# EAGLE board soundpuddle_standalone_mk1 (EAGLE 6.3), part 1 of 2
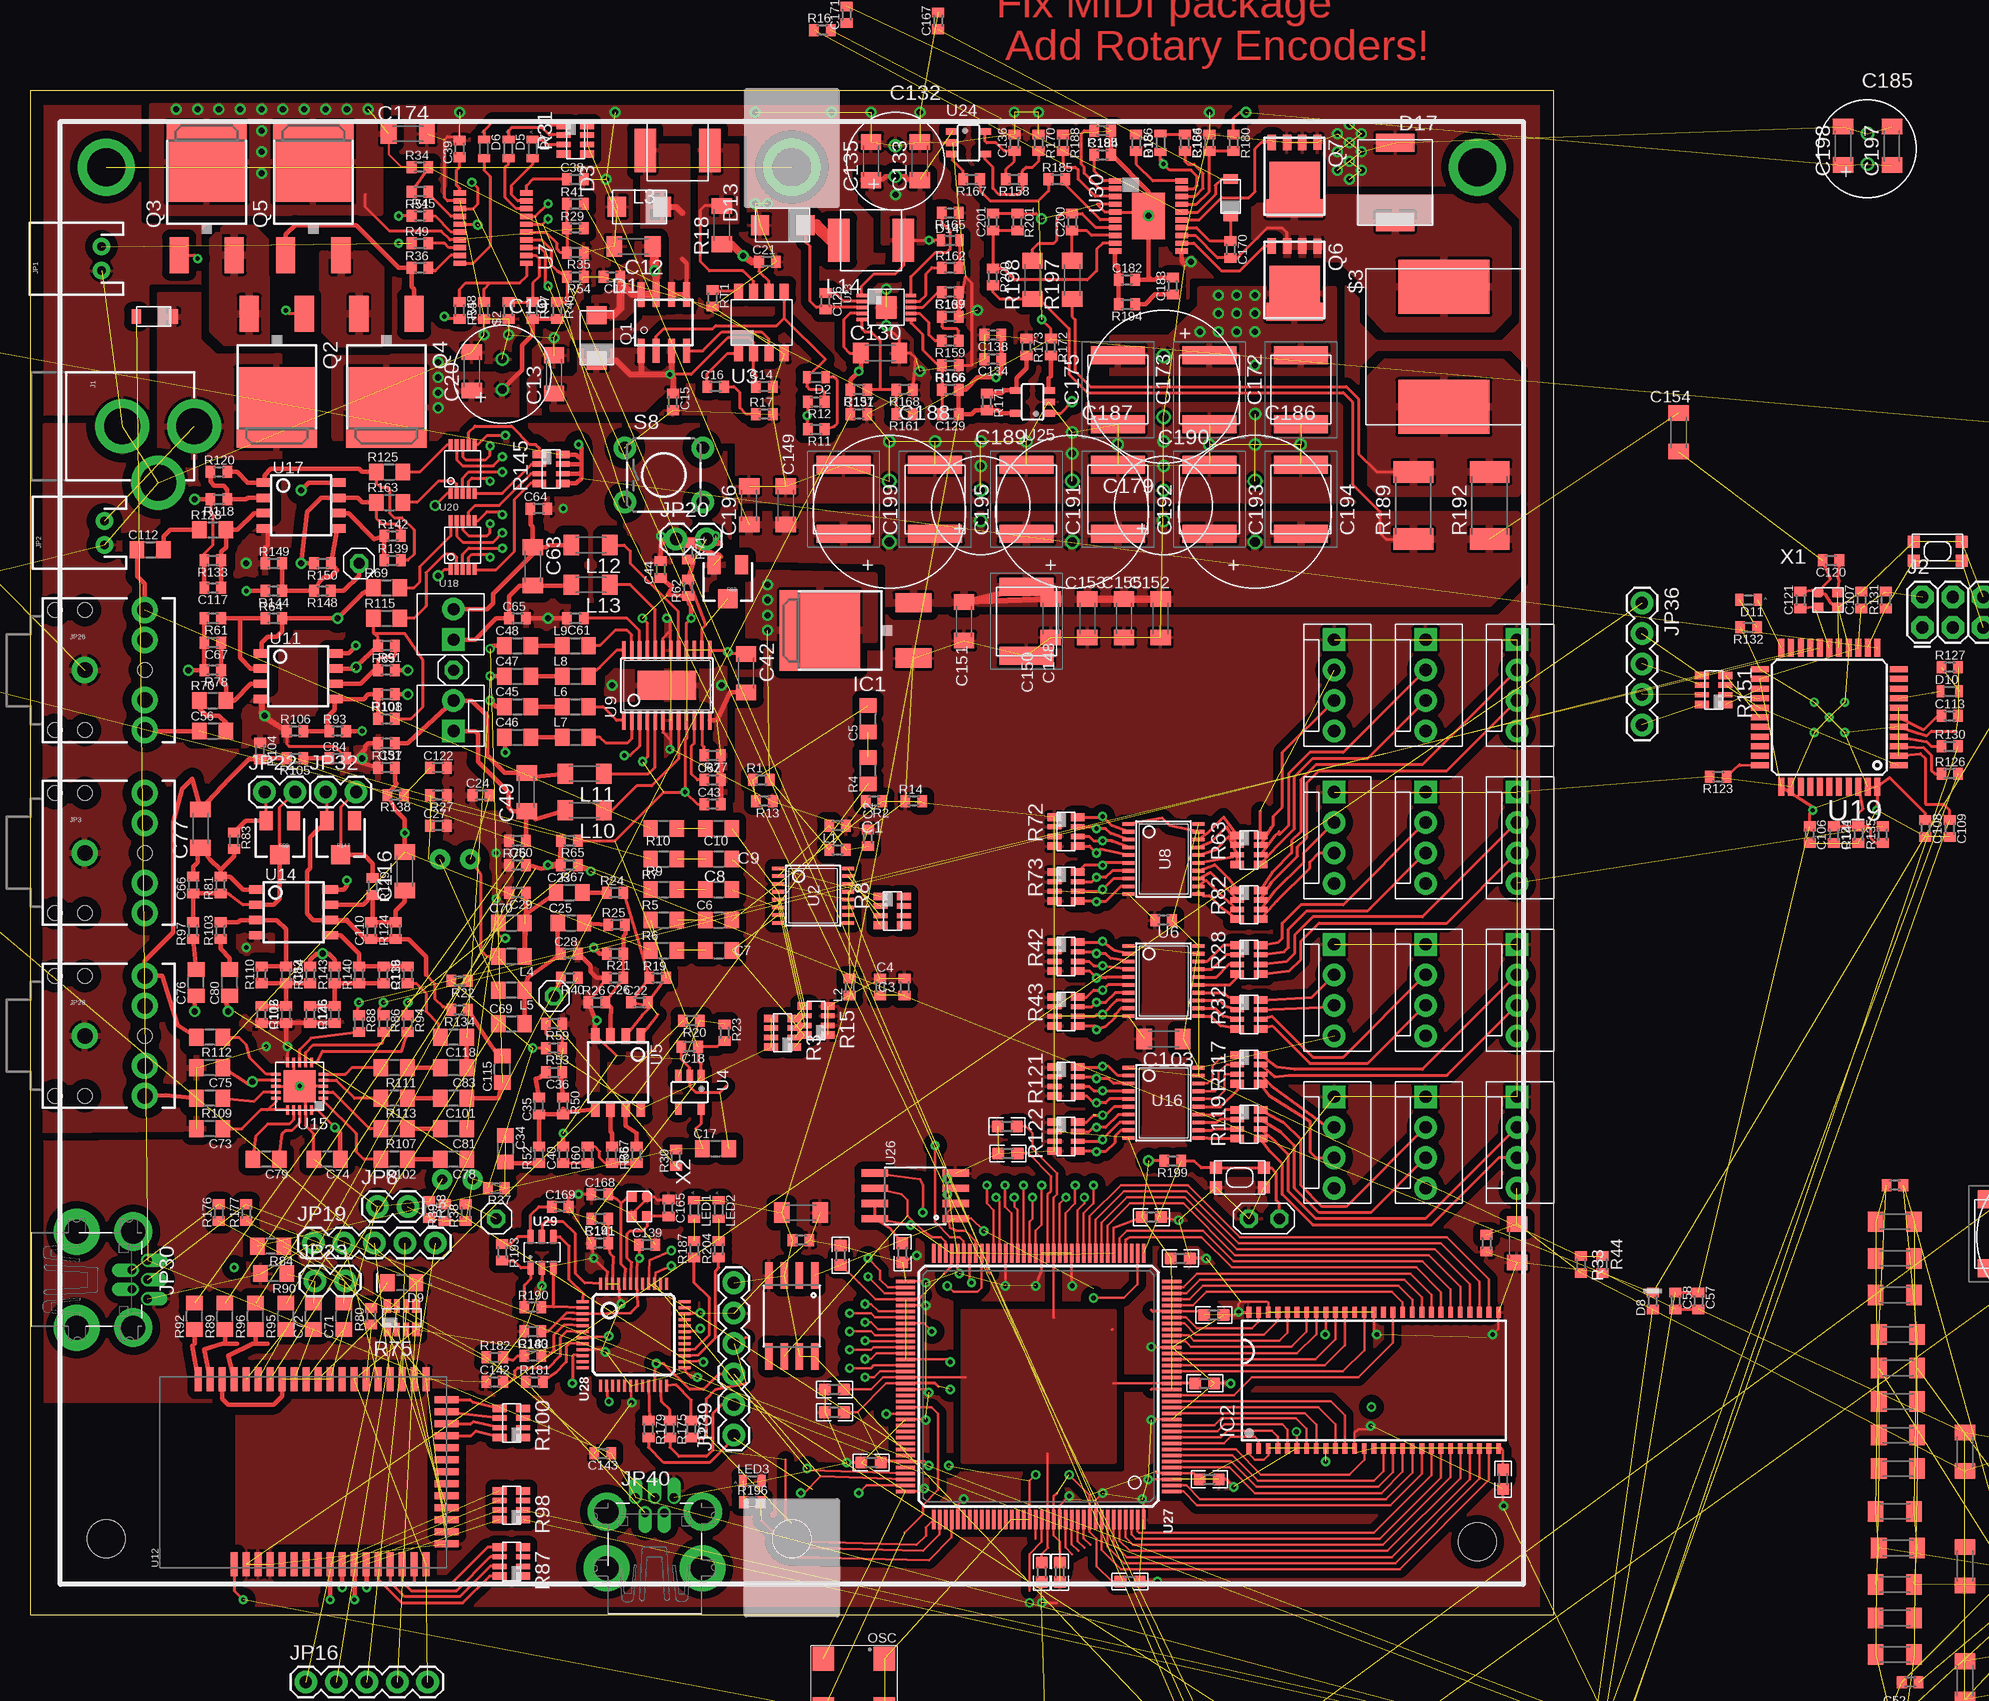
[diagram p8: board, top side]
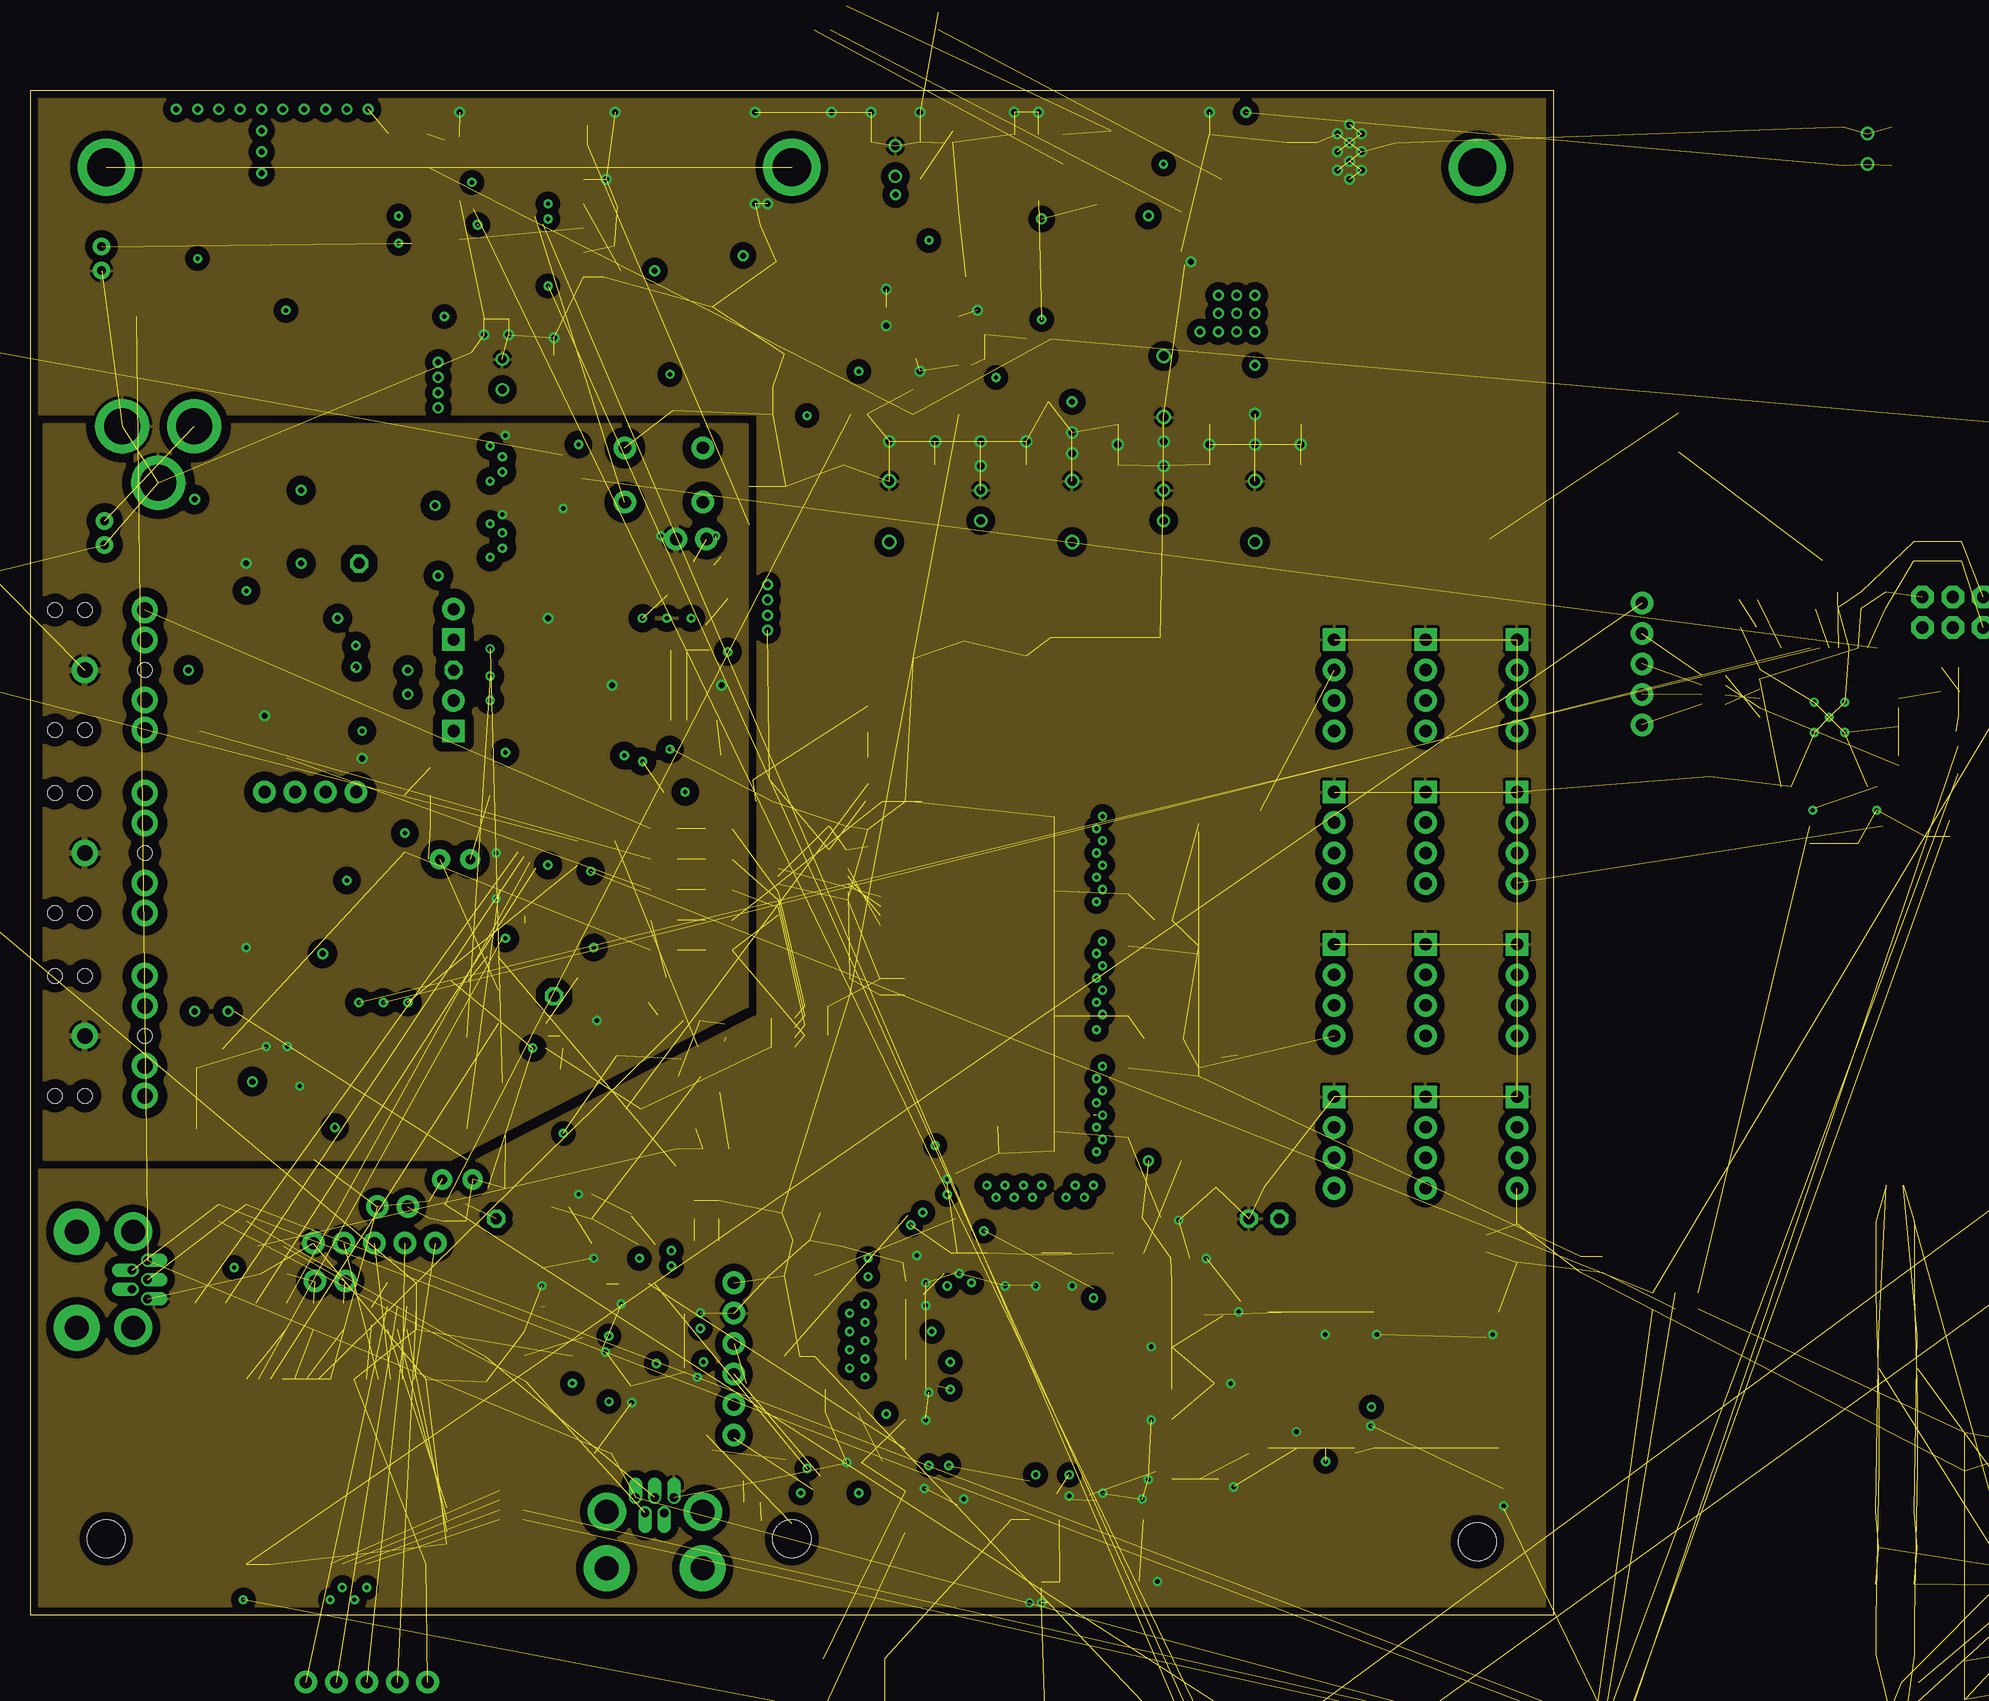
[diagram p9: board, inner layer GND]
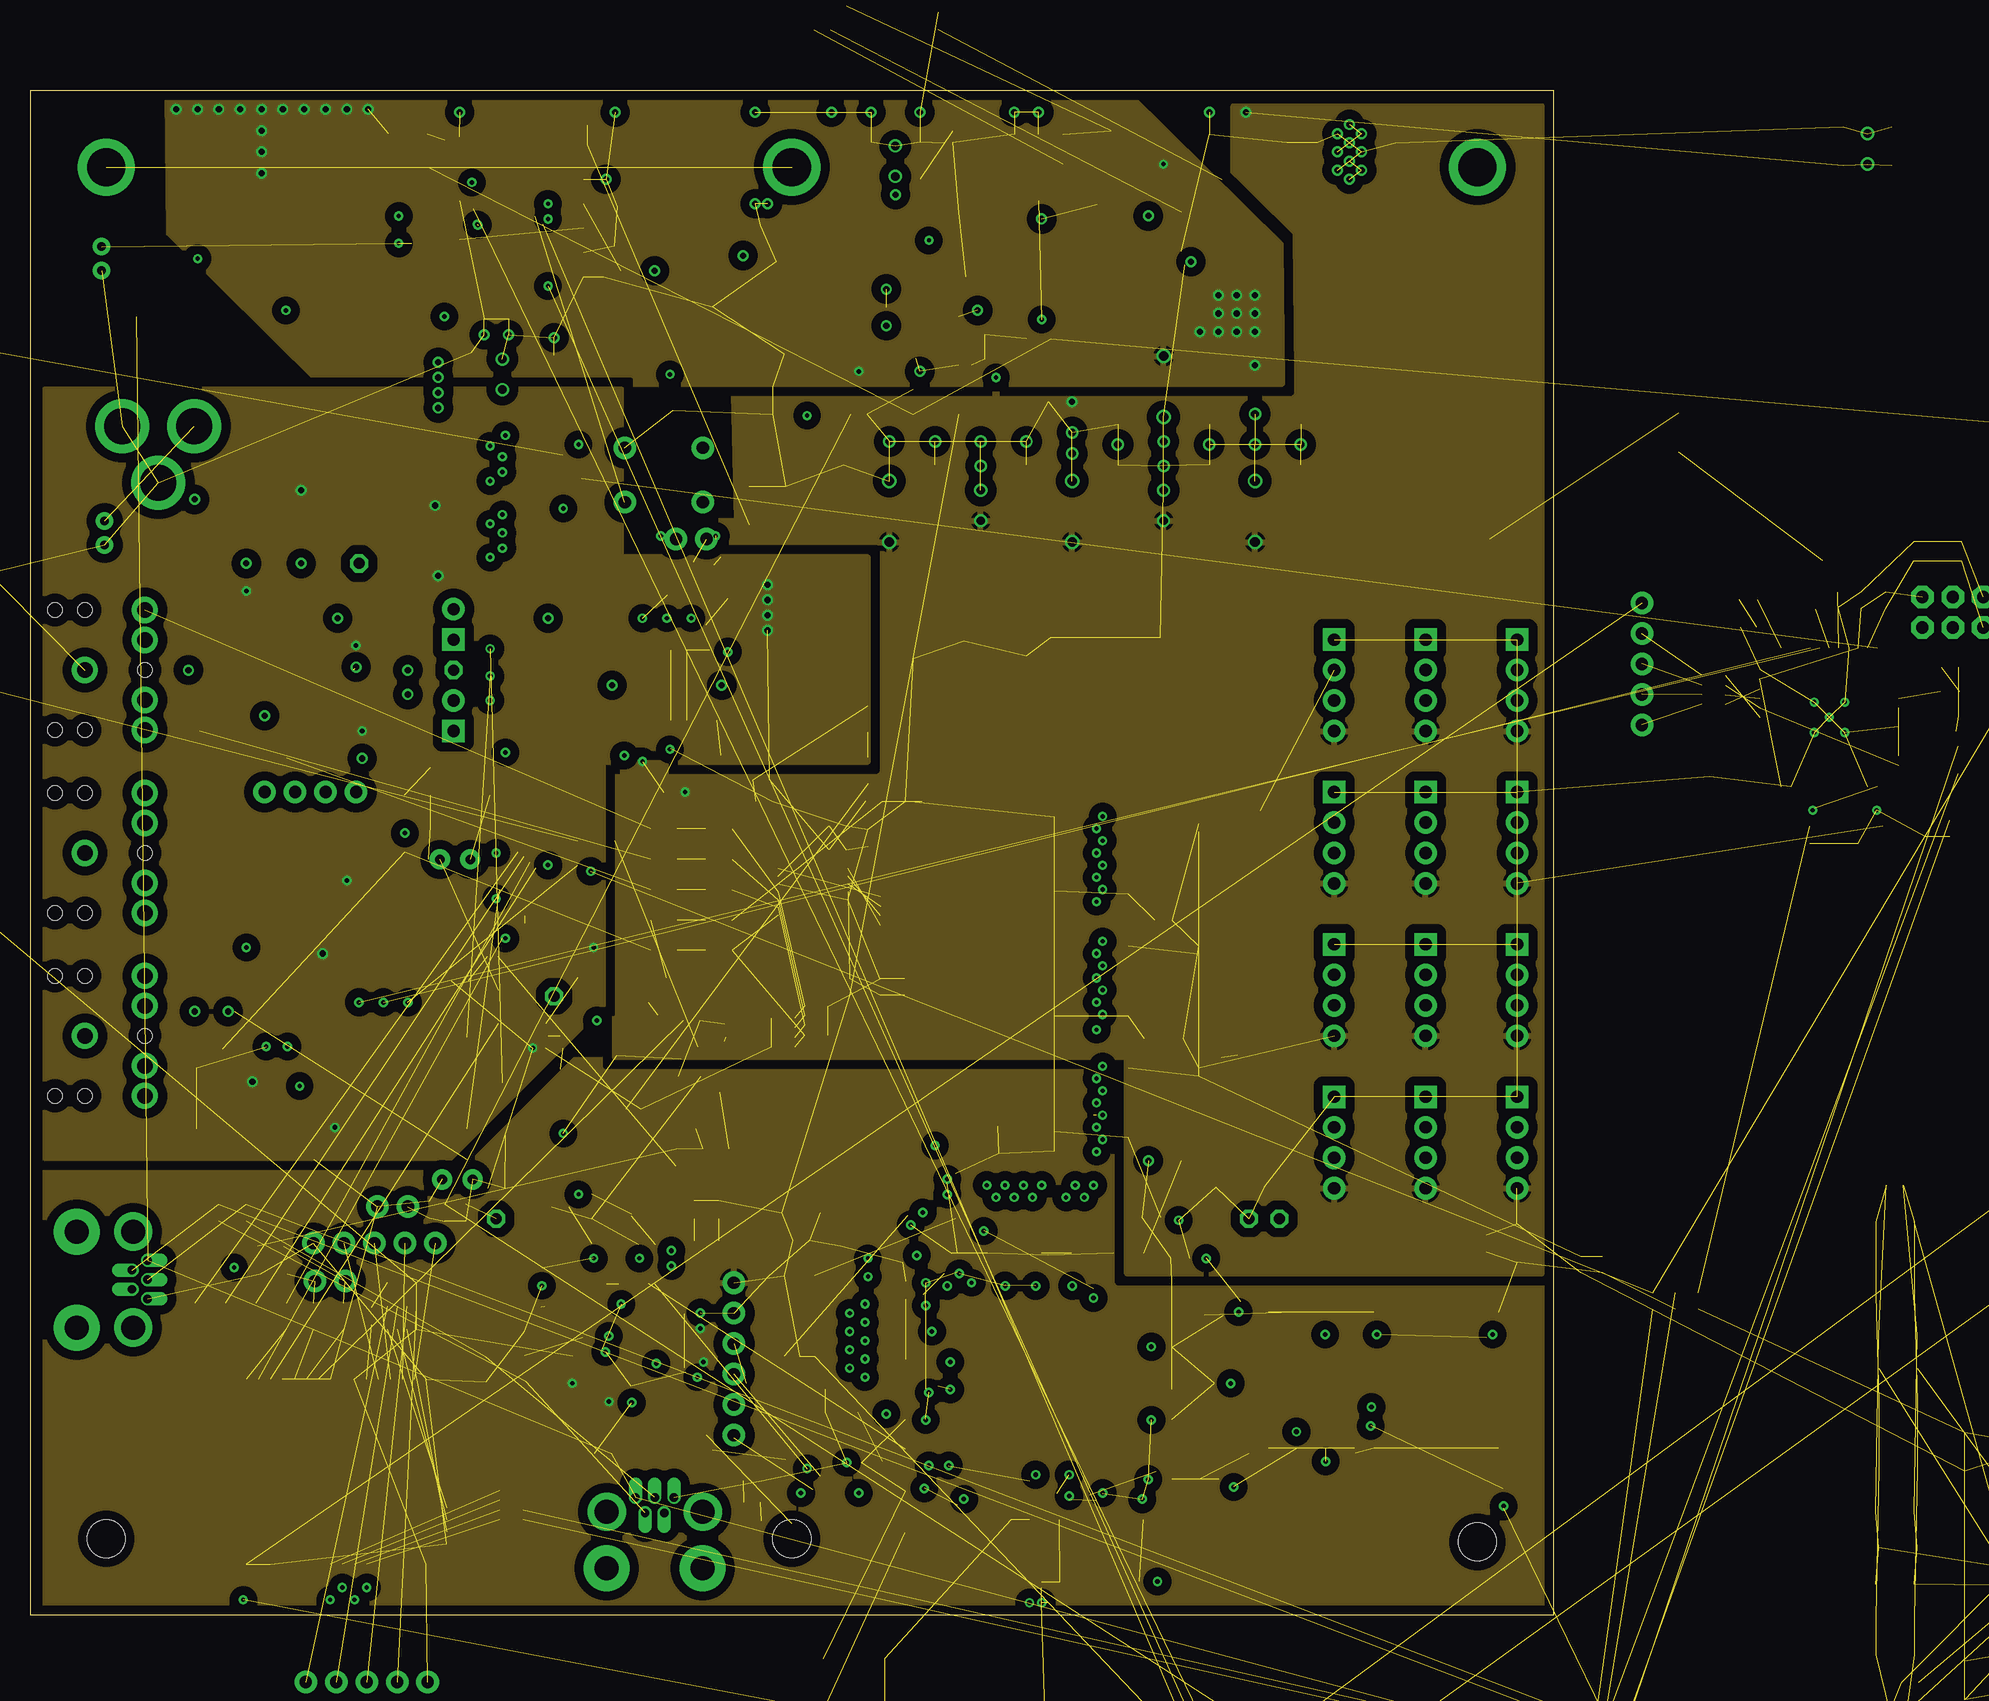
[diagram p10: board, inner layer POWER]
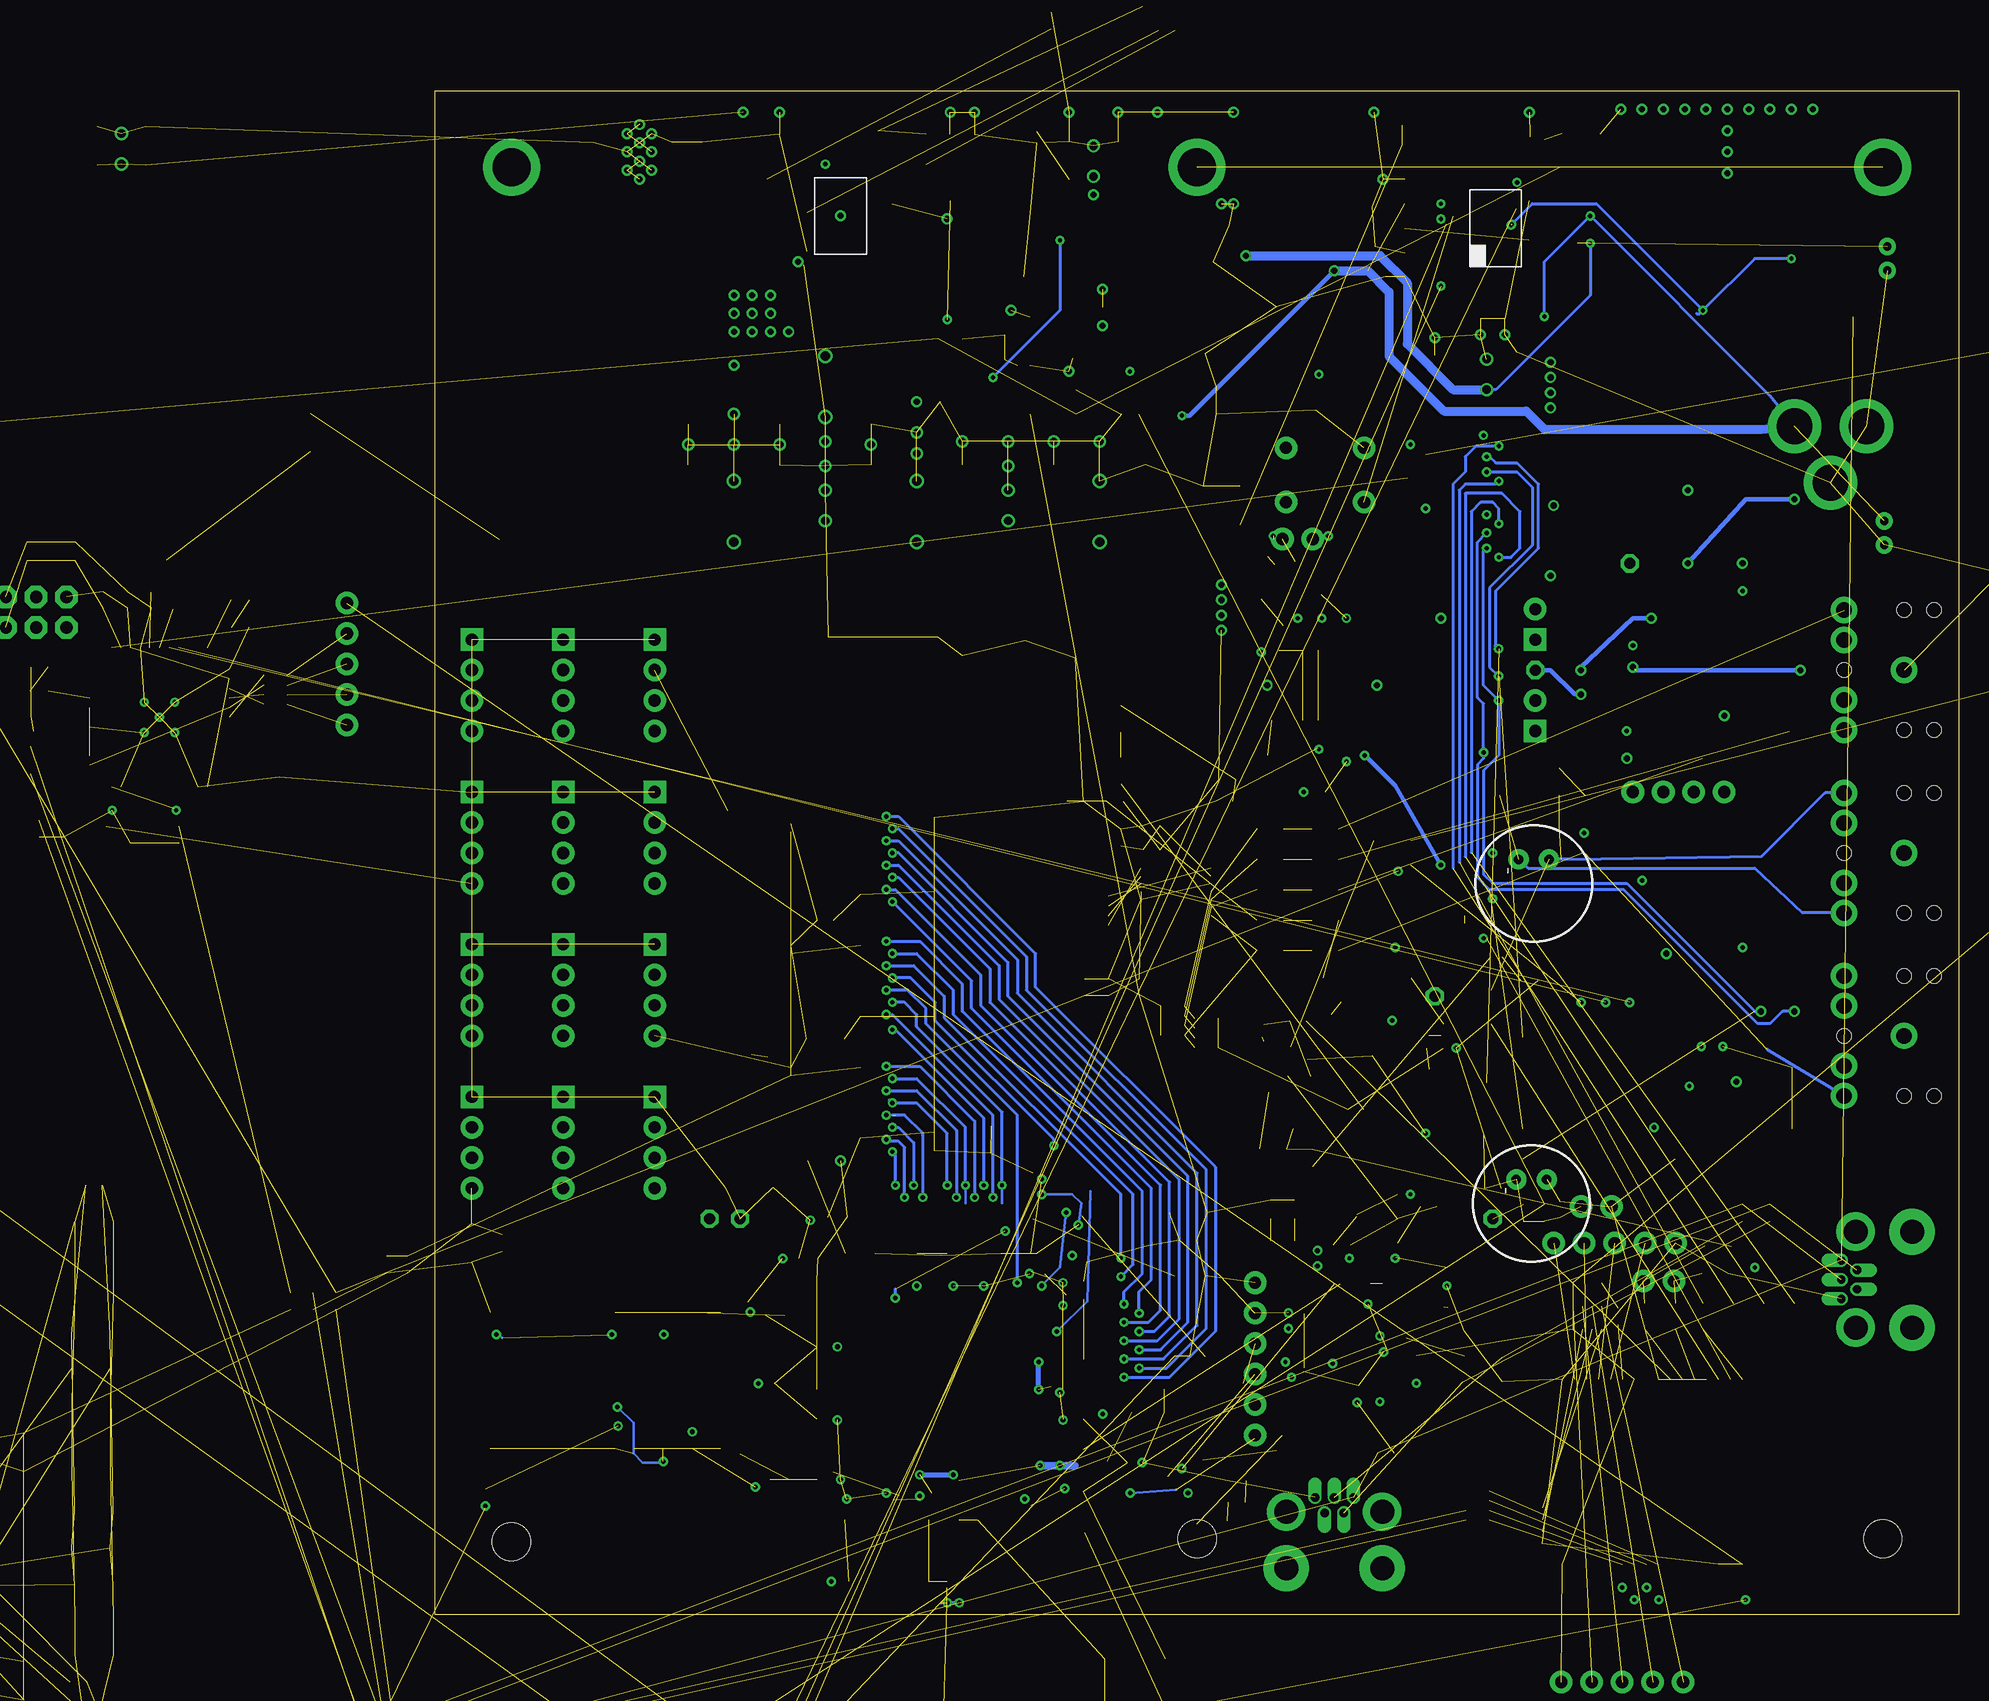
[diagram p11: board, bottom side, seen from below]

Size 127 x 127 mm. Coordinates in mm from the lower left corner, seen from the top.
Outline: 0,0 127,0 127,127 0,127 0,0
Copper layers (1+2*15+16): Top 0.0178mm / dielectric 12mil / GND 0.0356mm / dielectric 28mil / POWER 0.0356mm / dielectric 12mil / Bottom 0.0178mm
Design rules "SSC-EAGLE-4Lyr_v1.0.0.3": minimum track width 6mil, minimum drill 8mil, track to track 6mil, track to pad 6mil, pad to pad 6mil, via to via 6mil, smd to smd 6mil, copper to edge 20mil, drill to drill 16mil, minimum pad ring 8mil, minimum via ring 8mil, stop-mask expansion 3mil, vias tented up to drill 0mil, thermal gap 10mil
Net classes: 0 default: width 0.178 mm, drill 0.381 mm, clearance 0.178 mm
Holes 3.17 mm at 120.65,6.1 63.5,6.35 6.35,6.35
tRestrict: area 0.5,0 to 12.4,17
bRestrict: area 0.5,0 to 12.4,17
vRestrict: area 0.5,0 to 12.4,17

## Footprints (pad centres in the part's own frame; a part is rotated, then mirrored left to right if it is on the bottom)
0603 = smd 0.8 x 1: 1 -0.7,0; 2 0.7,0
INDUCTOR_HC1 = smd 4.5 x 7.62: P$1 -5,0; P$2 5,0
0805 = smd 1.2 x 1.4: 1 -1.1,0; 2 1.1,0
1206 = smd 1.3 x 1.7: P$1 -1.6,0; P$2 1.6,0
CAP_RADIAL_THRUHOLE_6.3MM_DIA = drill 0.7: P$1 0,-1.27; P$2 0,1.27
0603' = smd 1 x 1: 1 -0.8,0; 2 0.8,0
E5-8,5 = drill 1.016 pad 2.54: + -2.54,0 | drill 1.016 pad 2.54 octagon: - 2.54,0
2220 = smd 1.5 x 4.5: P$1 -2.875,0; P$2 2.875,0
CAP_RADIAL_THRUHOLE_12.5MM_DIA = drill 0.8: P$1 0,-2.54; P$2 0,2.54
DIODE_DO-214AC = smd 1.676 x 1.524: P$1 0,1.88; P$2 0,-1.88
LED_0603 = smd 0.65 x 1: 1 -0.775,0; 2 0.775,0
SOD-123F = smd 1.2 x 0.8: P$1 0,1.55; P$2 0,-1.55
0603_D = smd 0.8 x 1: ANNODE(1) -0.7,0; CATHODE(2) 0.7,0
LED_0805 = smd 1.2 x 1.4: 1 -1.2,0; 2 1.2,0
SOD-323 = smd 0.63 x 0.83: A 1.1,0; C -1.1,0
DIODE_DO-214AB = smd 3.2 x 1.524: A 0,-3.302; C 0,3.302
DPACK_1 = smd 1.6 x 3: 1 -2.3,-4.8; 3 2.3,-4.8 | smd 6.7 x 6.7: 2/HEAT 0,3
TSOP54-400 = smd 0.4 x 0.9: 1 -10.4,-5.68; 2 -9.6,-5.68; 3 -8.8,-5.68; 4 -8,-5.68; 5 -7.2,-5.68; 6 -6.4,-5.68; 7 -5.6,-5.68; 8 -4.8,-5.68; 9 -4,-5.68; 10 -3.2,-5.68; 11 -2.4,-5.68; 12 -1.6,-5.68; 13 -0.8,-5.68; 14 0,-5.68; 15 0.8,-5.68; 16 1.6,-5.68; 17 2.4,-5.68; 18 3.2,-5.68; 19 4,-5.68; 20 4.8,-5.68; 21 5.6,-5.68; 22 6.4,-5.68; 23 7.2,-5.68; 24 8,-5.68; 25 8.8,-5.68; 26 9.6,-5.68; 27 10.4,-5.68; 28 10.4,5.68; 29 9.6,5.68; 30 8.8,5.68; 31 8,5.68; 32 7.2,5.68; 33 6.4,5.68; 34 5.6,5.68; 35 4.8,5.68; 36 4,5.68; 37 3.2,5.68; 38 2.4,5.68; 39 1.6,5.68; 40 0.8,5.68; 41 0,5.68; 42 -0.8,5.68; 43 -1.6,5.68; 44 -2.4,5.68; 45 -3.2,5.68; 46 -4,5.68; 47 -4.8,5.68; 48 -5.6,5.68; 49 -6.4,5.68; 50 -7.2,5.68; 51 -8,5.68; 52 -8.8,5.68; 53 -9.6,5.68; 54 -10.4,5.68
POWER_JACK_PTH = drill 2.997 pad 4.318: GND 0,7.7; GNDBREAK 4.7,10.7; PWR 0,13.7
2X3 = drill 1.016 pad 1.88 octagon: 1 0,0; 2 0,2.54; 3 2.54,0; 4 2.54,2.54; 5 5.08,0; 6 5.08,2.54
JST-2-PTH = drill 0.7 pad 1.448: 1 -1,0; 2 1,0
AUDIO-JACK = drill 1.3 pad 2.184: RING 5,5; RSH 5,2.5; SLEEVE 0,0; TIP 5,-5; TSH 5,-2.5 | hole 1.2: 0,5; -2.5,5; -2.5,-5; 0,-5; 5,0
MOLEX-1X4 = drill 1.016 pad 1.88 square: 1 0,0 | drill 1.016 pad 1.88: 2 2.54,0; 3 5.08,0; 4 7.62,0
HEADER-SMALL-1PIN-0.036IN = drill 0.914 pad 1.524 octagon: P$1 0,0
1X02 = drill 1.016 pad 1.88: 1 0,0; 2 2.54,0
1X04 = drill 1.016 pad 1.88 square: 1 0,0 | drill 1.016 pad 1.88: 2 2.54,0; 3 5.08,0; 4 7.62,0
HEADER-SMALL-2PIN-0.036IN = drill 0.914 pad 1.524 octagon: P$1 0,0; P$2 2.54,0
MOLEX-1X2 = drill 1.016 pad 1.88 square: 1 0,0 | drill 1.016 pad 1.88: 2 2.54,0
HEADER-SMALL-3PIN-0.036IN = drill 0.914 pad 1.524 octagon: P$1 0,0; P$2 2.54,0; P$3 5.08,0
1X05 = drill 1.016 pad 1.88: 1 0,0; 2 2.54,0; 3 5.08,0; 4 7.62,0; 5 10.16,0
USB-MINIB-THM = drill 0.7 offset: D+ 0,9.8; D- -0.8,8.5; GND 1.6,9.8; ID 0.8,8.5; VBUS -1.6,9.8 | drill 2 pad 3.81: GND1 -4,3.9; GND4 4,3.9 | drill 2 pad 3.2: GND2 -4,8.6; GND3 4,8.6
HEADER-SMALL-4PIN-0.036IN = drill 0.914 pad 1.524 octagon: P$1 0,0; P$2 2.54,0; P$3 5.08,0; P$4 7.62,0
DIN_5_FEMALE_SUPPORT = drill 1.4 pad 2.286: 1 0.46,3.61; 2 -7.07,3.6; 3 7.94,3.6; 4 -4.53,6.12; 5 5.47,6.13; 6 -2.1,-6.4; 7 2.9,-6.4
1X06 = drill 1.016 pad 1.88: 1 0,0; 2 2.54,0; 3 5.08,0; 4 7.62,0; 5 10.16,0; 6 12.7,0
INDUCTOR_10X10MM = smd 1.803 x 3.607: P$1 -2.692,0; P$2 2.692,0
MIC-9.7MM = drill 0.8 pad 1.676: 1 -2,1.27; 2 -2,-1.27
OSC1 = smd 1.8 x 2: 1@1 0,0; 2@2 5.08,0; 3@3 5.08,4.2; 4@4 0,4.2
SOIC8 = smd 0.6 x 2.032: 1 -1.905,-2.346; 2 -0.635,-2.346; 3 0.635,-2.346; 4 1.905,-2.346; 5 1.905,2.346; 6 0.635,2.346; 7 -0.635,2.346; 8 -1.905,2.346
POWERPAK_SO-8_LFPAK = smd 1.25 x 0.7: 1S -2.825,1.905 | smd 1.27 x 0.7: 2S -2.825,0.635; 3S -2.825,-0.635; 4G -2.825,-1.905 | smd 4.6 x 4.2: PAD 1.1,0 | smd 1.5 x 4.7: PAD2 2.65,0
RESISTOR_ARRAY_1206_4CH_CRA06S = smd 0.63 x 1.15: P$1 -1.2,-0.975; P$4 1.2,-0.975; P$5 1.2,0.975; P$8 -1.2,0.975 | smd 0.44 x 1.15: P$2 -0.4,-0.975; P$3 0.4,-0.975; P$6 0.4,0.975; P$7 -0.4,0.975
TRIMPOT-3MM-2 = smd 1.092 x 1.6: 1 -1.155,-1.421; 3 1.155,-1.421 | smd 1.6 x 1.6: 2 0,1.421
2512 = smd 1.8 x 3.3: 1 -2.8,0; 2 2.8,0
TACTILE-PTH = drill 1.016 pad 1.88: 1 -3.251,2.261; 2 3.251,2.261; 3 -3.251,-2.261; 4 3.251,-2.261
KMR2 = smd 1 x 1: 1 2,0.8; 2 2,-0.8; 3 -2,0.8; 4 -2,-0.8
TSSOP16 = smd 0.305 x 0.991: 1 -2.275,-2.918; 2 -1.625,-2.918; 3 -0.975,-2.918; 4 -0.325,-2.918; 5 0.325,-2.918; 6 0.975,-2.918; 7 1.625,-2.918; 8 2.275,-2.918; 9 2.275,2.918; 10 1.625,2.918; 11 0.975,2.918; 12 0.325,2.918; 13 -0.325,2.918; 14 -0.975,2.918; 15 -1.625,2.918; 16 -2.275,2.918
S8_TI = smd 0.762 x 1.27: P$1 -1.905,-2.603; P$2 -0.635,-2.603; P$3 0.635,-2.603; P$4 1.905,-2.603; P$5 1.905,2.603; P$6 0.635,2.603; P$7 -0.635,2.603; P$8 -1.905,2.603
TSOT23 = smd 0.55 x 1.05: 1 -0.95,-1.35; 2 0,-1.35; 3 0.95,-1.35; 4 0.95,1.35; 5 -0.95,1.35
DMP8_NJM = smd 0.7 x 1.3: 1 -1.905,-3.05; 2 -0.635,-3.05; 3 0.635,-3.05; 4 1.905,-3.05; 5 1.905,3.05; 6 0.635,3.05; 7 -0.635,3.05; 8 -1.905,3.05
TSSOP20 = smd 0.305 x 0.991: 1 -2.925,-2.918; 2 -2.275,-2.918; 3 -1.625,-2.918; 4 -0.975,-2.918; 5 -0.325,-2.918; 6 0.325,-2.918; 7 0.975,-2.918; 8 1.625,-2.918; 9 2.275,-2.932; 10 2.925,-2.932; 11 2.925,2.918; 12 2.275,2.918; 13 1.625,2.918; 14 0.975,2.918; 15 0.325,2.918; 16 -0.325,2.918; 17 -0.975,2.918; 18 -1.625,2.918; 19 -2.275,2.918; 20 -2.925,2.918
TSSOP20_LT = smd 0.45 x 1.05: P$1 -2.925,-2.775; P$2 -2.275,-2.775; P$3 -1.625,-2.775; P$4 -0.975,-2.775; P$5 -0.325,-2.775; P$6 0.325,-2.775; P$7 0.975,-2.775; P$8 1.625,-2.775; P$9 2.275,-2.775; P$10 2.925,-2.775; P$11 2.925,2.775; P$12 2.275,2.775; P$13 1.625,2.775; P$14 0.975,2.775; P$15 0.325,2.775; P$16 -0.325,2.775; P$17 -0.975,2.775; P$18 -1.625,2.775; P$19 -2.275,2.775; P$20 -2.925,2.775
TSSOP24+1_TI = smd 0.3 x 1.55: 1 -3.575,-2.918; 2 -2.925,-2.918; 3 -2.275,-2.918; 4 -1.625,-2.918; 5 -0.975,-2.918; 6 -0.325,-2.918; 7 0.325,-2.918; 8 0.975,-2.918; 9 1.625,-2.918; 10 2.275,-2.918; 11 2.925,-2.918; 12 3.575,-2.918; 13 3.575,2.932; 14 2.925,2.932; 15 2.275,2.932; 16 1.625,2.932; 17 0.975,2.932; 18 0.325,2.932; 19 -0.325,2.932; 20 -0.975,2.932; 21 -1.625,2.932; 22 -2.275,2.918; 23 -2.925,2.918; 24 -3.575,2.918 | smd 4.87 x 2.4: PGND 0,0
LGA14 = smd 0.5 x 1.2: 1 2,1.1; 2 1.2,1.1; 3 0.4,1.1; 4 -0.4,1.1; 5 -1.2,1.1; 6 -2,1.1; 8 -2,-1.1; 9 -1.2,-1.1; 10 -0.4,-1.1; 11 0.4,-1.1; 12 1.2,-1.1; 13 2,-1.1 | smd 1.2 x 0.5: 7 -2.1,0; 14 2.1,0
WT32_BT_MODULE = smd 2 x 0.6: 1 -7.7,6.97; 2 -7.7,5.97; 3 -7.7,4.97; 4 -7.7,3.97; 5 -7.7,2.97; 6 -7.7,1.97; 7 -7.7,0.97; 8 -7.7,-0.03; 9 -7.7,-1.03; 10 -7.7,-2.03; 11 -7.7,-3.03; 12 -7.7,-4.03; 13 -7.7,-5.03; 14 -7.7,-6.03; 15 -7.7,-7.03; 16 -7.7,-8.03; 17 -7.7,-9.03; 31 7.7,-9.03; 32 7.7,-8.03; 33 7.7,-7.03; 34 7.7,-6.03; 35 7.7,-5.03; 36 7.7,-4.03; 37 7.7,-3.03; 38 7.7,-2.03; 39 7.7,-1.03; 40 7.7,-0.03; 41 7.7,0.97; 42 7.7,1.97; 43 7.7,2.97; 44 7.7,3.97; 45 7.7,4.97; 46 7.7,5.97; 47 7.7,6.97; 48 7.7,7.97; 49 7.7,8.97; 50 7.7,9.97 | smd 0.6 x 2: 18 -6,-10.73; 19 -5,-10.73; 20 -4,-10.73; 21 -3,-10.73; 22 -2,-10.73; 23 -1,-10.73; 24 0,-10.73; 25 1,-10.73; 26 2,-10.73; 27 3,-10.73; 28 4,-10.73; 29 5,-10.73; 30 6,-10.73
SOT23-6L = smd 0.55 x 1.05: 1 -0.95,-1.15; 2 0,-1.15; 3 0.95,-1.15 | smd 0.6 x 1.2: 4 0.95,1.15; 5 0,1.15; 6 -0.95,1.15
QFN20+1 = smd 0.8 x 0.25: P$1 -1.975,1; P$2 -1.975,0.5; P$3 -1.975,0; P$4 -1.975,-0.5; P$5 -1.975,-1; P$11 1.975,-1; P$12 1.975,-0.5; P$13 1.975,0; P$14 1.975,0.5; P$15 1.975,1 | smd 0.25 x 0.8: P$6 -1,-1.975; P$7 -0.5,-1.975; P$8 0,-1.975; P$9 0.5,-1.975; P$10 1,-1.975; P$16 1,1.975; P$17 0.5,1.975; P$18 0,1.975; P$19 -0.5,1.975; P$20 -1,1.975 | smd 2.65 x 2.65: PAD 0,0
MSOP10 = smd 0.305 x 0.889: 1 -1,-2.045; 2 -0.5,-2.045; 3 0,-2.045; 4 0.5,-2.045; 5 1,-2.045; 6 1,2.045; 7 0.5,2.045; 8 0,2.045; 9 -0.5,2.045; 10 -1,2.045
TQFP44 = smd 1.5 x 0.5: 1 -5.8,4; 2 -5.8,3.2; 3 -5.8,2.4; 4 -5.8,1.6; 5 -5.8,0.8; 6 -5.8,0; 7 -5.8,-0.8; 8 -5.8,-1.6; 9 -5.8,-2.4; 10 -5.8,-3.2; 11 -5.8,-4; 23 5.8,-4; 24 5.8,-3.2; 25 5.8,-2.4; 26 5.8,-1.6; 27 5.8,-0.8; 28 5.8,0; 29 5.8,0.8; 30 5.8,1.6; 31 5.8,2.4; 32 5.8,3.2; 33 5.8,4 | smd 0.5 x 1.5: 12 -4,-5.8; 13 -3.2,-5.8; 14 -2.4,-5.8; 15 -1.6,-5.8; 16 -0.8,-5.8; 17 0,-5.8; 18 0.8,-5.8; 19 1.6,-5.8; 20 2.4,-5.8; 21 3.2,-5.8; 22 4,-5.8; 34 4,5.8; 35 3.2,5.8; 36 2.4,5.8; 37 1.6,5.8; 38 0.8,5.8; 39 0,5.8; 40 -0.8,5.8; 41 -1.6,5.8; 42 -2.4,5.8; 43 -3.2,5.8; 44 -4,5.8
SO08-EIAJ = smd 0.61 x 2.21: 1 -1.905,-3.378; 2 -0.635,-3.378; 3 0.635,-3.378; 4 1.905,-3.378; 5 1.905,3.353; 6 0.635,3.353; 7 -0.635,3.353; 8 -1.905,3.353
SMD-8 = smd 1.27 x 1.27: P$1 -3.81,-3.81; P$2 -1.27,-3.81; P$3 1.27,-3.81; P$4 3.81,-3.81; P$5 3.81,3.81; P$6 1.27,3.81; P$7 -1.27,3.81; P$8 -3.81,3.81
MSOP10+1_LT = smd 0.305 x 0.889: P$1 -1,-2.045; P$2 -0.5,-2.045; P$3 0,-2.045; P$4 0.5,-2.045; P$5 1,-2.045; P$6 1,2.045; P$7 0.5,2.045; P$8 0,2.045; P$9 -0.5,2.045; P$10 -1,2.045 | smd 1.88 x 1.68: P$11 0,0
TQ144 = smd 1.6 x 0.3: 1 -11.1,8.75; 2 -11.1,8.25; 3 -11.1,7.75; 4 -11.1,7.25; 5 -11.1,6.75; 6 -11.1,6.25; 7 -11.1,5.75; 8 -11.1,5.25; 9 -11.1,4.75; 10 -11.1,4.25; 11 -11.1,3.75; 12 -11.1,3.25; 13 -11.1,2.75; 14 -11.1,2.25; 15 -11.1,1.75; 16 -11.1,1.25; 17 -11.1,0.75; 18 -11.1,0.25; 19 -11.1,-0.25; 20 -11.1,-0.75; 21 -11.1,-1.25; 22 -11.1,-1.75; 23 -11.1,-2.25; 24 -11.1,-2.75; 25 -11.1,-3.25; 26 -11.1,-3.75; 27 -11.1,-4.25; 28 -11.1,-4.75; 29 -11.1,-5.25; 30 -11.1,-5.75; 31 -11.1,-6.25; 32 -11.1,-6.75; 33 -11.1,-7.25; 34 -11.1,-7.75; 35 -11.1,-8.25; 36 -11.1,-8.75; 73 11.1,-8.75; 74 11.1,-8.25; 75 11.1,-7.75; 76 11.1,-7.25; 77 11.1,-6.75; 78 11.1,-6.25; 79 11.1,-5.75; 80 11.1,-5.25; 81 11.1,-4.75; 82 11.1,-4.25; 83 11.1,-3.75; 84 11.1,-3.25; 85 11.1,-2.75; 86 11.1,-2.25; 87 11.1,-1.75; 88 11.1,-1.25; 89 11.1,-0.75; 90 11.1,-0.25; 91 11.1,0.25; 92 11.1,0.75; 93 11.1,1.25; 94 11.1,1.75; 95 11.1,2.25; 96 11.1,2.75; 97 11.1,3.25; 98 11.1,3.75; 99 11.1,4.25; 100 11.1,4.75; 101 11.1,5.25; 102 11.1,5.75; 103 11.1,6.25; 104 11.1,6.75; 105 11.1,7.25; 106 11.1,7.75; 107 11.1,8.25; 108 11.1,8.75 | smd 0.3 x 1.6: 37 -8.75,-11.1; 38 -8.25,-11.1; 39 -7.75,-11.1; 40 -7.25,-11.1; 41 -6.75,-11.1; 42 -6.25,-11.1; 43 -5.75,-11.1; 44 -5.25,-11.1; 45 -4.75,-11.1; 46 -4.25,-11.1; 47 -3.75,-11.1; 48 -3.25,-11.1; 49 -2.75,-11.1; 50 -2.25,-11.1; 51 -1.75,-11.1; 52 -1.25,-11.1; 53 -0.75,-11.1; 54 -0.25,-11.1; 55 0.25,-11.1; 56 0.75,-11.1; 57 1.25,-11.1; 58 1.75,-11.1; 59 2.25,-11.1; 60 2.75,-11.1; 61 3.25,-11.1; 62 3.75,-11.1; 63 4.25,-11.1; 64 4.75,-11.1; 65 5.25,-11.1; 66 5.75,-11.1; 67 6.25,-11.1; 68 6.75,-11.1; 69 7.25,-11.1; 70 7.75,-11.1; 71 8.25,-11.1; 72 8.75,-11.1; 109 8.75,11.1; 110 8.25,11.1; 111 7.75,11.1; 112 7.25,11.1; 113 6.75,11.1; 114 6.25,11.1; 115 5.75,11.1; 116 5.25,11.1; 117 4.75,11.1; 118 4.25,11.1; 119 3.75,11.1; 120 3.25,11.1; 121 2.75,11.1; 122 2.25,11.1; 123 1.75,11.1; 124 1.25,11.1; 125 0.75,11.1; 126 0.25,11.1; 127 -0.25,11.1; 128 -0.75,11.1; 129 -1.25,11.1; 130 -1.75,11.1; 131 -2.25,11.1; 132 -2.75,11.1; 133 -3.25,11.1; 134 -3.75,11.1; 135 -4.25,11.1; 136 -4.75,11.1; 137 -5.25,11.1; 138 -5.75,11.1; 139 -6.25,11.1; 140 -6.75,11.1; 141 -7.25,11.1; 142 -7.75,11.1; 143 -8.25,11.1; 144 -8.75,11.1
LQFP48 = smd 0.25 x 1: 1 -2.75,-4.25; 2 -2.25,-4.25; 3 -1.75,-4.25; 4 -1.25,-4.25; 5 -0.75,-4.25; 6 -0.25,-4.25; 7 0.25,-4.25; 8 0.75,-4.25; 9 1.25,-4.25; 10 1.75,-4.25; 11 2.25,-4.25; 12 2.75,-4.25; 25 2.75,4.25; 26 2.25,4.25; 27 1.75,4.25; 28 1.25,4.25; 29 0.75,4.25; 30 0.25,4.25; 31 -0.25,4.25; 32 -0.75,4.25; 33 -1.25,4.25; 34 -1.75,4.25; 35 -2.25,4.25; 36 -2.75,4.25 | smd 1 x 0.25: 13 4.25,-2.75; 14 4.25,-2.25; 15 4.25,-1.75; 16 4.25,-1.25; 17 4.25,-0.75; 18 4.25,-0.25; 19 4.25,0.25; 20 4.25,0.75; 21 4.25,1.25; 22 4.25,1.75; 23 4.25,2.25; 24 4.25,2.75; 37 -4.25,2.75; 38 -4.25,2.25; 39 -4.25,1.75; 40 -4.25,1.25; 41 -4.25,0.75; 42 -4.25,0.25; 43 -4.25,-0.25; 44 -4.25,-0.75; 45 -4.25,-1.25; 46 -4.25,-1.75; 47 -4.25,-2.25; 48 -4.25,-2.75
SOT23-6 = smd 0.55 x 1.2: 1 -0.95,-1.3; 2 0,-1.3; 3 0.95,-1.3; 4 0.95,1.3; 5 0,1.3; 6 -0.95,1.3
TSSOP20+1_LT = smd 0.45 x 1.05: P$1 -2.925,-2.775; P$2 -2.275,-2.775; P$3 -1.625,-2.775; P$4 -0.975,-2.775; P$5 -0.325,-2.775; P$6 0.325,-2.775; P$7 0.975,-2.775; P$8 1.625,-2.775; P$9 2.275,-2.775; P$10 2.925,-2.775; P$11 2.925,2.775; P$12 2.275,2.775; P$13 1.625,2.775; P$14 0.975,2.775; P$15 0.325,2.775; P$16 -0.325,2.775; P$17 -0.975,2.775; P$18 -1.625,2.775; P$19 -2.275,2.775; P$20 -2.925,2.775 | smd 3.86 x 2.74: PAD 0,0
ABRACOM_CLOCK = smd 0.889 x 0.813: 1 -0.826,-0.635; 2 0.826,-0.635; 3 0.826,0.635; 4 -0.826,0.635
GND-GNDA = smd 1.27 x 1.27: GND -1.27,0; GNDA 1.27,0

## Placement (x,y rotation side)
$2  changeme  [0603]  39.88,108.71 90 top
$3  3.6uH  [INDUCTOR_HC1]  117.86,105.66 270 top
C1  0.1uF  [0603]  67.31,65.79 0 top
C2  1uF  [0603]  69.85,64.77 90 top
C3  0.1uF  [0603]  72.9,52.32 90 top
C4  1uF  [0603]  70.87,52.32 90 top
C5  10uF  [0805]  69.85,74.68 90 top
C6  10uF  [0805]  57.4,57.91 0 top
C7  1uF  [0805]  57.4,55.37 0 top
C8  10uF  [0805]  57.4,60.45 0 top
C9  10uF  [0805]  57.4,62.99 0 top
C10  10uF  [0805]  57.4,65.53 0 top
C11  22uF  [0603]  48.51,111.51 180 top
C12  22uF  [1206]  50.29,114.05 180 top
C13  22uF  [1206]  43.69,103.38 90 top
C14  1uF  [0603]  61.21,102.36 0 top
C15  1uF  [0603]  53.59,101.09 270 top
C16  0.47uF  [0603]  57.15,102.36 0 top
C17  1uF  [0805]  57.15,38.86 0 top
C18  1uF  [0603]  54.99,47.37 180 top
C19  [CAP_RADIAL_THRUHOLE_6.3MM_DIA]  39.37,103.38 180 top
C20  22uF  [1206]  36.83,103.63 90 top
C21  1uF  [0603]  61.47,112.78 0 top
C22  15pF  [0603]  50.8,51.05 0 top
C23  1uF  [0805]  44.96,60.2 0 top
C24  15pF  [0603]  37.59,68.33 0 top
C25  1uF  [0805]  45.09,57.66 0 top
C26  1uF  [0603]  48.77,53.09 180 top
C27  15pF  [0603]  34.04,65.79 0 top
C28  15pF  [0603]  44.96,55.12 0 top
C29  15pF  [0603]  40.64,60.2 180 top
C30  10uF  [0603]  94.49,57.91 180 top
C31  1uF  [0603]  170.69,-4.32 270 top  (outside the outline)
C32  47uF  [1206]  167.89,-4.32 270 top  (outside the outline)
C33  47uF  [1206]  161.29,-5.46 270 top  (outside the outline)
C34  1uF  [0805]  39.62,38.86 270 top
C35  15pF  [0603]  42.42,42.42 90 top
C36  15pF  [0603]  43.69,45.21 180 top
C37  47uF  [1206]  161.29,4.06 270 top  (outside the outline)
C38  22nF  [0603]  45.47,119.63 0 top
C39  22nF  [0603]  35.81,122.17 90 top
C40  15pF  [0603]  44.45,38.35 90 top
C41  47uF  [1206]  161.29,13.59 270 top  (outside the outline)
C42  10uF  [1206]  59.69,78.49 270 top
C43  1uF  [0603]  56.9,67.56 0 top
C44  1uF  [0603]  52.58,87.12 90 top
C45  1uF  [0805]  40.64,75.69 0 top
C46  1uF  [0805]  40.64,73.15 0 top
C47  1uF  [0805]  40.64,78.23 0 top
C48  1uF  [0805]  40.64,80.77 0 top
C49  1uF  [1206]  41.4,68.58 90 top
C50  0.22uF  [0603]  40.64,64.52 180 top
C51  0.22uF  [0603]  29.72,72.64 180 top
C52  10uF  [0603]  155.7,-8.13 0 top  (outside the outline)
C53  1uF  [0603]  156.72,-5.59 0 top  (outside the outline)
C54  1uF  [0603]  89.79,-20.95 180 top  (outside the outline)
C55  47uF  [1206]  123.95,30.99 90 top
C56  1uF  [0805]  15.24,73.66 0 top
C57  0.1uF  [0603]  139.06,26.16 270 top  (outside the outline)
C58  1uF  [0603]  137.16,26.16 270 top  (outside the outline)
C59  10uF  [1206]  94.23,-10.54 180 top  (outside the outline)
C60  47uF  [1206]  155.45,-3.3 180 top  (outside the outline)
C61  1uF  [0603]  45.47,83.06 180 top
C62  220pF  [0603]  56.9,69.6 0 top
C63  1uF  [1206]  41.91,87.38 270 top
C64  0.22uF  [0603]  42.42,92.2 0 top
C65  0.22uF  [0603]  40.64,83.06 0 top
C66  33pF  [0603]  13.59,60.83 90 top
C67  DNP  [0603]  15.24,81.03 180 top
C68  47uF  [1206]  155.45,-0.25 180 top  (outside the outline)
C69  1uF  [0805]  40.13,49.28 0 top
C70  1uF  [0805]  40.13,57.66 0 top
C71  1uF  [0805]  26.16,24.89 90 top
C72  1uF  [0805]  23.62,24.89 90 top
C73  1uF  [0805]  14.99,40.51 180 top
C74  1uF  [0805]  24.77,37.97 180 top
C75  1uF  [0805]  14.99,45.59 180 top
C76  1uF  [0805]  13.84,52.7 90 top
C77  10uF  [1206]  14.22,65.53 90 top
C78  0.47uF  [0805]  35.31,37.97 180 top
C79  1uF  [0805]  19.69,37.97 180 top
C80  1uF  [0805]  16.64,52.7 90 top
C81  0.47uF  [0805]  35.31,40.51 180 top
C82  33pF  [0603]  21.34,53.34 270 top
C83  0.47uF  [0805]  35.31,45.59 180 top
C84  0.1uF  [0603]  25.65,71.37 0 top
C85  .1uF  [0603']  67.06,16.89 180 top
C86  .1uF  [0603']  85.85,3.56 270 top
C87  .1uF  [0603']  81.51,38.46 180 top
C88  .1uF  [0603']  95.88,29.72 0 top
C89  .1uF  [0603']  81.46,40.72 180 top
C90  .1uF  [0603']  84.33,3.56 270 top
C91  .1uF  [0603']  97.92,19.3 0 top
C92  .1uF  [0603']  67.06,18.8 180 top
C93  .1uF  [0603']  67.56,29.97 90 top
C94  .1uF  [0603']  70.1,12.7 180 top
C95  .1uF  [0603']  93.47,33.15 0 top
C96  .1uF  [0603']  122.78,11.3 270 top
C97  .1uF  [0603']  98.3,11.3 0 top
C98  .1uF  [0603']  91.69,2.79 0 top
C99  .1uF  [0603']  98.68,24.99 0 top
C100  .1uF  [0603']  72.72,30.18 270 top
C101  0.47uF  [0805]  35.31,43.05 180 top
C102  2.2uF  [0603]  19.3,50.04 270 top
C103  1uF  [1206]  94.49,48.01 180 top
C104  1uF  [0603]  155.45,35.81 0 top  (outside the outline)
C105  47uF  [1206]  155.7,23.37 180 top  (outside the outline)
C106  1uF  [0603]  148.34,65.02 270 top  (outside the outline)
C107  1uF  [0603]  152.65,84.58 90 top  (outside the outline)
C108  1uF  [0603]  157.99,65.53 270 top  (outside the outline)
C109  1uF  [0603]  160.02,65.53 270 top  (outside the outline)
C110  33pF  [0603]  28.45,57.02 90 top
C111  47uF  [1206]  155.45,8.64 180 top  (outside the outline)
C112  1uF  [0805]  10.03,88.77 0 top
C113  1uF  [0603]  160.02,74.93 0 top  (outside the outline)
C114  47uF  [1206]  155.7,5.59 180 top  (outside the outline)
C115  1uF  [0805]  39.37,45.47 90 top
C116  10uF  [1206]  31.24,61.98 90 top
C117  DNP  [0603]  15.24,85.6 180 top
C118  1uF  [0805]  35.31,48.13 180 top
C119  33pF  [0603]  29.46,53.34 270 top
C120  22pF  [0603]  150.11,87.88 180 top  (outside the outline)
C121  22pF  [0603]  147.57,84.58 90 top  (outside the outline)
C122  0.1uF  [0603]  34.04,70.61 0 top
C123  47uF  [1206]  155.45,2.54 180 top  (outside the outline)
C124  0.1uF  [0603]  150.37,65.02 270 top  (outside the outline)
C125  2.2uF  [0603]  23.37,50.04 270 top
C126  0.47uF  [0603]  66.29,109.47 270 top
C127  1uF  [0603]  64.26,31.24 0 top
C128  DNP  [1206]  64.26,33.53 0 top
C129  10pF  [0603]  76.71,100.08 180 top
C130  22uF  [1206]  70.87,105.16 0 top
C131  0.1uF  [0603]  69.09,100.08 0 top
C132  2.2mF  [CAP_RADIAL_THRUHOLE_6.3MM_DIA]  72.14,121.16 180 top
C133  22uF  [1206]  74.17,121.16 90 top
C134  1uF  [0603]  80.26,104.65 180 top
C135  0.1uF  [1206]  70.1,121.16 90 top
C136  1uF  [0603]  82.04,122.68 90 top
C137  1nF  [0603]  76.71,108.2 0 top
C138  1uF  [0603]  80.26,106.68 180 top
C139  0.1uF  [0603]  51.44,30.86 0 top
C140  0.1uF  [0603]  41.91,23.62 180 top
C141  0.1uF  [0603]  47.5,30.99 0 top
C142  0.1uF  [0603]  38.73,19.43 0 top
C143  0.1uF  [0603]  47.75,13.46 180 top
C144  1mF  [E5-8,5]  168.4,13.46 0 top  (outside the outline)
C145  1mF  [E5-8,5]  177.55,13.46 0 top  (outside the outline)
C146  1mF  [E5-8,5]  168.15,2.29 180 top  (outside the outline)
C147  1mF  [E5-8,5]  177.8,2.29 0 top  (outside the outline)
C148  47uF  [1206]  85.09,83.06 270 top
C149  47uF  [1206]  62.99,92.46 90 top
C150  47uF  [2220]  83.06,82.8 270 top
C151  47uF  [1206]  77.85,82.8 270 top
C152  47uF  [1206]  94.23,83.06 270 top
C153  47uF  [1206]  88.14,83.06 270 top
C154  47uF  [1206]  137.41,98.55 270 top  (outside the outline)
C155  47uF  [1206]  91.19,83.06 270 top
C156  47uF  [1206]  164.59,-5.08 270 top  (outside the outline)
C157  47uF  [1206]  155.7,20.57 180 top  (outside the outline)
C158  47uF  [1206]  155.45,26.67 0 top  (outside the outline)
C159  47uF  [1206]  155.45,29.72 0 top  (outside the outline)
C160  47uF  [1206]  155.45,32.77 0 top  (outside the outline)
C161  47uF  [1206]  155.7,17.78 0 top  (outside the outline)
C162  47uF  [1206]  155.7,14.99 0 top  (outside the outline)
C163  47uF  [1206]  155.7,12.19 0 top  (outside the outline)
C164  0.1uF  [0603]  121.41,30.99 270 top
C165  22pF  [0603]  53.21,33.91 270 top
C166  2200pF  [0603]  98.3,122.68 90 top
C167  4.7uF  [0603]  75.69,132.84 90 top  (outside the outline)
C168  22pF  [0603]  47.5,35.05 0 top
C169  0.1uF  [0603]  44.2,34.04 0 top
C170  4.7uF  [0603]  100.08,113.79 270 top
C171  0.1uF  [0603]  68.07,133.35 90 top  (outside the outline)
C172  47uF  [2220]  105.92,102.11 270 top
C173  47uF  [2220]  98.3,102.11 270 top
C174  47uF  [1206]  31.5,123.44 0 top
C175  47uF  [2220]  90.68,102.11 270 top
C176  47uF  [1206]  178.05,32 90 top  (outside the outline)
C177  100uF  [2220]  164.59,31.75 90 top  (outside the outline)
C178  100uF  [2220]  172.47,31.75 90 top  (outside the outline)
C179  [CAP_RADIAL_THRUHOLE_12.5MM_DIA]  94.49,102.36 0 top
C180  [CAP_RADIAL_THRUHOLE_12.5MM_DIA]  168.66,31.5 180 top  (outside the outline)
C181  [CAP_RADIAL_THRUHOLE_6.3MM_DIA]  180.09,32 180 top  (outside the outline)
C182  100pF  [0603]  91.44,111.25 0 top
C183  2200pF  [0603]  95.25,110.74 90 top
C184  0.1uF  [0603]  89.41,121.67 0 top
C185  [CAP_RADIAL_THRUHOLE_6.3MM_DIA]  153.16,122.17 180 top  (outside the outline)
C186  [CAP_RADIAL_THRUHOLE_12.5MM_DIA]  102.11,91.95 180 top
C187  [CAP_RADIAL_THRUHOLE_12.5MM_DIA]  86.87,91.95 180 top
C188  [CAP_RADIAL_THRUHOLE_12.5MM_DIA]  71.63,91.95 180 top
C189  [CAP_RADIAL_THRUHOLE_6.3MM_DIA]  79.25,92.46 180 top
C190  [CAP_RADIAL_THRUHOLE_6.3MM_DIA]  94.49,92.46 180 top
C191  100uF  [2220]  83.06,92.96 90 top
C192  100uF  [2220]  90.68,92.96 90 top
C193  100uF  [2220]  98.3,92.96 90 top
C194  100uF  [2220]  105.92,92.96 90 top
C195  100uF  [2220]  75.44,92.96 90 top
C196  47uF  [1206]  59.94,92.46 90 top
C197  47uF  [1206]  155.19,122.43 90 top  (outside the outline)
C198  47uF  [1206]  151.13,122.43 90 top  (outside the outline)
C199  100uF  [2220]  67.82,92.96 90 top
C200  4.7nF  [0603]  86.87,116.08 90 top
C201  100pF  [0603]  80.26,116.08 90 top
D1  DNP  [DIODE_DO-214AC]  47.24,106.43 180 top
D2  [LED_0603]  65.53,103.12 180 top
D3  [DIODE_DO-214AC]  50.8,117.35 270 top
D4  [SOD-123F]  10.41,108.2 270 top
D5  [LED_0603]  39.88,122.17 270 top
D6  [LED_0603]  37.85,122.17 270 top
D7  [LED_0603]  41.91,122.17 270 top
D8  [0603_D]  135.25,26.16 90 top  (outside the outline)
D9  [LED_0805]  30.99,27.69 180 top
D10  RED  [LED_0603]  160.02,76.96 0 top  (outside the outline)
D11  RED  [LED_0603]  143.26,84.58 180 top  (outside the outline)
D12  [SOD-323]  -35.31,84.07 90 top  (outside the outline)
D13  [DIODE_DO-214AC]  62.74,115.82 270 top
D14  [LED_0603]  76.71,114.55 0 top
D15  [LED_0603]  94.23,122.68 90 top
D16  [SOD-123F]  100.08,118.11 180 top
D17  [DIODE_DO-214AB]  113.79,119.38 180 top
IC1  [DPACK_1]  68.83,82.04 90 top
IC2  MT48LC64M4A2  [TSOP54-400]  112.01,19.56 0 top
J1  POWER_JACKPTH  [POWER_JACK_PTH]  0,99.06 270 top
J2  AVR_SPI_PRG_6PTH  [2X3]  157.73,82.3 0 top  (outside the outline)
JP1  [JST-2-PTH]  5.97,113.03 90 top
JP2  [JST-2-PTH]  6.22,90.17 90 top
JP3  AUDIO-JACK2PTH  [AUDIO-JACK]  4.57,63.5 0 top
JP4  [MOLEX-1X4]  116.33,68.58 270 top
JP5  HEADER-SMALL-1PIN  [HEADER-SMALL-1PIN-0.036IN]  38.86,33.02 90 top
JP6  HEADER-SMALL-1PIN  [HEADER-SMALL-1PIN-0.036IN]  43.69,51.56 270 top
JP7  [MOLEX-1X4]  123.95,68.58 270 top
JP8  [1X02]  28.96,34.04 0 top
JP9  [1X04]  101.98,-25.27 90 top  (outside the outline)
JP10  HEADER-SMALL-2PIN  [HEADER-SMALL-2PIN-0.036IN]  174.62,98.42 0 top  (outside the outline)
JP11  [MOLEX-1X4]  108.71,55.88 270 top
JP12  [MOLEX-1X4]  116.33,55.88 270 top
JP13  [MOLEX-1X2]  35.31,73.66 90 top
JP14  [MOLEX-1X4]  108.71,81.28 270 top
JP15  HEADER-SMALL-3PIN  [HEADER-SMALL-3PIN-0.036IN]  89.79,-12.06 180 top  (outside the outline)
JP16  [1X05]  22.99,-5.59 0 top  (outside the outline)
JP17  [MOLEX-1X2]  35.31,81.28 90 top
JP18  [MOLEX-1X4]  116.33,81.28 270 top
JP19  [1X05]  23.62,30.99 0 top
JP20  [1X02]  53.85,89.66 0 top
JP21  [MOLEX-1X4]  123.95,81.28 270 top
JP22  [1X02]  19.56,68.58 0 top
JP23  [1X02]  23.75,27.81 0 top
JP24  [MOLEX-1X4]  108.71,68.58 270 top
JP25  HEADER-SMALL-1PIN  [HEADER-SMALL-1PIN-0.036IN]  35.31,78.74 0 top
JP26  AUDIO-JACK2PTH  [AUDIO-JACK]  4.57,78.74 0 top
JP27  [MOLEX-1X4]  123.95,55.88 270 top
JP28  AUDIO-JACK2PTH  [AUDIO-JACK]  4.57,48.26 0 top
JP29  [MOLEX-1X4]  108.71,43.18 270 top
JP30  [USB-MINIB-THM]  0,27.94 270 top
JP31  HEADER-SMALL-2PIN  [HEADER-SMALL-2PIN-0.036IN]  -22.73,106.3 90 top  (outside the outline)
JP32  [1X02]  24.64,68.58 0 top
JP33  [MOLEX-1X4]  116.33,43.18 270 top
JP34  [MOLEX-1X4]  123.95,43.18 270 top
JP35  HEADER-SMALL-1PIN  [HEADER-SMALL-1PIN-0.036IN]  27.43,87.63 0 top
JP36  [1X05]  134.37,84.33 270 top  (outside the outline)
JP37  HEADER-SMALL-4PIN  [HEADER-SMALL-4PIN-0.036IN]  -38.86,90.17 180 top  (outside the outline)
JP38  MIDI_CONN_FEMALE_SUPPORT  [DIN_5_FEMALE_SUPPORT]  -40.64,105.03 90 top  (outside the outline)
JP39  [1X06]  58.67,14.99 90 top
JP40  [USB-MINIB-THM]  52.07,0 0 top
JP41  HEADER-SMALL-2PIN  [HEADER-SMALL-2PIN-0.036IN]  101.6,33.02 0 top
L1  [0603]  67.31,63.75 0 top
L2  [0603]  68.33,52.32 90 top
L3  6.8uH  [INDUCTOR_10X10MM]  53.98,122.05 0 top
L4  15nH  [0805]  40.13,54.86 180 top
L5  15nH  [0805]  40.13,52.07 180 top
L6  [0805]  45.47,75.69 0 top
L7  [0805]  45.47,73.15 0 top
L8  [0805]  45.47,78.23 0 top
L9  [0805]  45.47,80.77 0 top
L10  15uH  [1206]  46.23,67.06 180 top
L11  15uH  [1206]  46.23,70.1 180 top
L12  15uH  [1206]  46.74,89.15 180 top
L13  15uH  [1206]  46.74,85.85 180 top
L14  [INDUCTOR_10X10MM]  70.1,114.55 0 top
LED1  [LED_0603]  55.37,33.78 270 top
LED2  [LED_0603]  57.4,33.78 270 top
LED3  [LED_0603]  60.2,11.18 0 top
MIC1  MIC9.7MM  [MIC-9.7MM]  35.43,60.96 270 bottom
MIC2  MIC9.7MM  [MIC-9.7MM]  35.62,34.29 270 bottom
OSC  32Mhz  [OSC1]  71.22,-3.66 180 top  (outside the outline)
Q1  MOSFET-P_CH_DUAL_ARRAYSOIC8  [SOIC8]  52.83,107.7 0 top
Q2  MOSFET-P_CHANNELDPACK  [DPACK_1]  20.57,103.63 180 top
Q3  MOSFET-P_CHANNELDPACK  [DPACK_1]  14.73,118.11 0 top
Q4  MOSFET-P_CHANNELDPACK  [DPACK_1]  29.72,103.63 180 top
Q5  MOSFET-P_CHANNELDPACK  [DPACK_1]  23.62,118.11 0 top
Q6  [POWERPAK_SO-8_LFPAK]  105.41,111.25 270 top
Q7  [POWERPAK_SO-8_LFPAK]  105.41,119.89 270 top
R1  DNP  [0603]  60.96,69.6 0 top
R2  DNP  [0603]  70.36,67.82 180 top
R3  [RESISTOR_ARRAY_1206_4CH_CRA06S]  62.74,48.51 90 top
R4  10  [0805]  69.85,70.36 90 top
R5  10  [0805]  52.83,57.91 0 top
R6  10  [0805]  52.83,55.37 0 top
R7  10  [0805]  52.83,60.45 0 top
R8  [RESISTOR_ARRAY_1206_4CH_CRA06S]  71.88,58.67 270 top
R9  10  [0805]  52.83,62.99 0 top
R10  10  [0805]  52.83,65.53 0 top
R11  1K  [0603]  65.53,98.81 180 top
R12  100K  [0603]  65.53,101.09 180 top
R13  DNP  [0603]  61.21,67.82 180 top
R14  DNP  [0603]  73.66,67.82 0 top
R15  [RESISTOR_ARRAY_1206_4CH_CRA06S]  65.53,49.53 90 top
R16  7.5K  [0603]  66.04,132.08 0 top  (outside the outline)
R17  2.2K  [0603]  61.21,100.08 0 top
R18  0.033  [1206]  57.66,115.82 90 top
R19  1M  [0603]  52.32,53.09 0 top
R20  10K  [0603]  55.12,49.53 180 top
R21  10K  [0603]  48.77,55.12 180 top
R22  DNP  [0603]  35.81,52.83 180 top
R23  DNP  [0603]  57.91,48.51 270 top
R24  10K  [0603]  48.77,60.2 0 top
R25  0  [0603]  48.89,57.53 0 top
R26  10K  [0603]  47.24,51.05 0 top
R27  1K  [0603]  34.04,68.33 180 top
R28  [RESISTOR_ARRAY_1206_4CH_CRA06S]  101.6,54.61 270 top
R29  121K  [0603]  45.47,115.57 0 top
R30  1K  [0603]  53.85,38.1 90 top
R31  1K  [RESISTOR_ARRAY_1206_4CH_CRA06S]  45.47,122.94 270 top
R32  [RESISTOR_ARRAY_1206_4CH_CRA06S]  101.6,50.04 270 top
R33  DNP  [0603]  129.29,29.21 270 top
R34  100K  [0603]  32.51,120.65 0 top
R35  121K  [0603]  45.47,113.54 180 top
R36  1K  [0603]  32.51,112.27 0 top
R37  100K  [0603]  38.86,35.56 180 top
R38  100K  [0603]  36.32,33.53 90 top
R39  100K  [0603]  34.54,33.53 90 top
R40  100K  [0603]  44.96,53.09 180 top
R41  DNP  [0603]  45.47,117.6 0 top
R42  DNP  [RESISTOR_ARRAY_1206_4CH_CRA06S]  86.36,54.86 270 top
R43  DNP  [RESISTOR_ARRAY_1206_4CH_CRA06S]  86.36,50.29 270 top
R44  2.2K  [0603]  131.06,29.21 90 top  (outside the outline)
R45  10K  [0603]  32.51,118.62 180 top
R46  changeme  [0603]  43.94,108.71 270 top
R47  changeme  [0603]  41.91,108.71 270 top
R48  changeme  [0603]  35.81,108.71 270 top
R49  1K  [0603]  32.51,114.3 0 top
R50  47K  [0603]  44.45,42.42 270 top
R51  1K  [0603]  32.51,116.59 0 top
R52  1K  [0603]  42.42,38.35 90 top
R53  100K  [0603]  43.69,47.24 180 top
R54  changeme  [0603]  45.47,111.51 180 top
R55  changeme  [0603]  37.85,108.71 90 top
R56  DNP  [0603]  175.89,96.14 180 top  (outside the outline)
R57  1M  [0603]  48.51,38.35 270 top
R58  100K  [0603]  33.27,33.78 270 top
R59  100K  [0603]  43.69,49.28 180 top
R60  100K  [0603]  46.48,38.35 90 top
R61  2.2K  [0603]  15.24,83.06 180 top
R62  DNP  [0603]  54.86,85.6 90 top
R63  [RESISTOR_ARRAY_1206_4CH_CRA06S]  101.6,63.75 270 top
R64  2.2K  [0603]  20.32,83.06 0 top
R65  DNP  [0603]  44.96,64.52 180 top
R66  100K  [0603]  50.55,38.35 90 top
R67  10K  [0603]  44.96,62.48 180 top
R68  TRIMPOT3MM-2  [TRIMPOT-3MM-2]  58.17,86.11 180 top
R69  1  [0805]  29.72,85.6 0 top
R70  10K  [0805]  15.24,76.2 0 top
R71  DNP  [0603]  54.86,88.65 270 top
R72  DNP  [RESISTOR_ARRAY_1206_4CH_CRA06S]  86.36,65.28 270 top
R73  DNP  [RESISTOR_ARRAY_1206_4CH_CRA06S]  86.36,60.71 270 top
R74  100K  [0603]  128.27,-22.48 0 top  (outside the outline)
R75  [RESISTOR_ARRAY_1206_4CH_CRA06S]  30.99,24.77 0 top
R76  10K  [0603]  40.64,62.48 0 top
R77  121K  [0603]  56.9,71.63 180 top
R78  10K  [0603]  15.24,78.74 180 top
R79  10K  [0603]  128.27,-19.69 180 top  (outside the outline)
R80  2.2K  [0603]  28.45,24.89 90 top
R81  43K  [0603]  15.88,60.83 90 top
R82  [RESISTOR_ARRAY_1206_4CH_CRA06S]  101.6,59.18 270 top
R83  43K  [0603]  17.02,64.52 270 top
R84  10K  [0805]  20.07,30.73 180 top
R85  2.2K  [0603]  29.72,78.74 0 top
R86  0  [0603]  29.46,49.28 270 top
R87  22  [RESISTOR_ARRAY_1206_4CH_CRA06S]  40.13,4.45 90 top
R88  0  [0603]  27.43,49.28 270 top
R89  1  [0805]  16.26,24.89 90 top
R90  10K  [0805]  20.32,28.45 180 top
R91  2.2K  [0603]  29.72,80.77 180 top
R92  1  [0805]  13.72,24.89 90 top
R93  10K  [0603]  25.65,73.66 0 top
R94  10K  [0603]  31.5,49.28 270 top
R95  1  [0805]  21.34,24.89 90 top
R96  1  [0805]  18.8,24.89 90 top
R97  22K  [0603]  13.59,57.02 90 top
R98  [RESISTOR_ARRAY_1206_4CH_CRA06S]  40.13,9.14 90 top
R99  TRIMPOT3MM-2  [TRIMPOT-3MM-2]  20.83,64.77 180 top
R100  [RESISTOR_ARRAY_1206_4CH_CRA06S]  40.13,16 90 top
R101  DNP  [0603]  29.72,76.71 180 top
R102  1  [0805]  30.35,37.97 180 top
R103  22K  [0603]  15.88,57.02 90 top
R104  100K  [0603]  19.18,72.01 270 top
R105  39  [0603]  22.1,71.37 180 top
R106  10K  [0603]  22.1,73.66 0 top
R107  1  [0805]  30.35,40.51 180 top
R108  DNP  [0603]  29.72,74.68 0 top
R109  22  [0805]  14.99,43.05 180 top
R110  43K  [0603]  19.3,53.34 90 top
R111  1  [0805]  30.35,45.59 180 top
R112  22  [0805]  14.99,48.13 180 top
R113  1  [0805]  30.35,43.05 180 top
R114  100K  [0603]  23.37,53.34 90 top
R115  1  [0805]  29.72,83.06 0 top
R116  100K  [0603]  21.34,50.04 90 top
R117  [RESISTOR_ARRAY_1206_4CH_CRA06S]  101.6,45.47 270 top
R118  2.2K  [0603]  15.75,92.96 180 top
R119  [RESISTOR_ARRAY_1206_4CH_CRA06S]  101.6,40.89 270 top
R120  2.2K  [0603]  15.75,95.25 0 top
R121  DNP  [RESISTOR_ARRAY_1206_4CH_CRA06S]  86.36,44.45 270 top
R122  DNP  [RESISTOR_ARRAY_1206_4CH_CRA06S]  86.36,39.88 270 top
R123  1K  [0603]  140.72,69.85 180 top  (outside the outline)
R124  43K  [0603]  30.48,57.02 90 top
R125  1  [0805]  29.97,95.25 0 top
R126  22  [0603]  160.02,70.1 0 top  (outside the outline)
R127  1K  [0603]  160.02,78.99 0 top  (outside the outline)
R128  10K  [0805]  15.24,90.42 0 top
R129  43K  [0603]  28.58,60.71 270 top
R130  22  [0603]  160.02,72.39 0 top  (outside the outline)
R131  10K  [0603]  154.69,84.58 90 top  (outside the outline)
R132  1K  [0603]  143.26,82.3 180 top  (outside the outline)
R133  10K  [0603]  15.24,87.88 180 top
R134  22K  [0603]  35.81,50.42 180 top
R135  DNP  [0603]  154.43,65.02 90 top  (outside the outline)
R136  22K  [0603]  31.5,53.34 90 top
R137  100K  [0603]  29.72,70.61 0 top
R138  39  [0603]  30.48,68.33 180 top
R139  2.2K  [0603]  30.23,87.88 0 top
R140  43K  [0603]  27.43,53.34 90 top
R141  DNP  [0603]  152.4,65.02 90 top  (outside the outline)
R142  2.2K  [0603]  30.23,89.92 0 top
R143  100K  [0603]  25.4,53.34 90 top
R144  10K  [0603]  20.32,85.34 180 top
R145  [RESISTOR_ARRAY_1206_4CH_CRA06S]  43.43,95.5 270 top
R146  100K  [0603]  25.4,50.04 90 top
R147  TRIMPOT3MM-2  [TRIMPOT-3MM-2]  25.91,64.77 180 top
R148  DNP  [0603]  24.38,85.34 180 top
R149  10K  [0603]  20.32,87.63 0 top
R150  DNP  [0603]  24.38,87.63 180 top
R151  [RESISTOR_ARRAY_1206_4CH_CRA06S]  140.33,77.09 90 top  (outside the outline)
R152  330  [0603]  -33.02,87.88 90 top  (outside the outline)
R153  330  [0603]  -33.02,84.07 90 top  (outside the outline)
R154  220  [0603]  -35.31,80.26 90 top  (outside the outline)
R155  220  [0603]  -35.43,91.44 90 top  (outside the outline)
R156  1M  [0603]  76.71,102.11 0 top
R157  10K  [0603]  69.09,102.11 180 top
R158  DNP  [0603]  82.04,119.63 180 top
R159  100K  [0603]  76.71,106.17 180 top
R160  390  [0603]  -33.15,91.44 90 top  (outside the outline)
R161  10K  [0603]  72.9,100.08 180 top
R162  1K  [0603]  76.71,112.27 0 top
R163  1  [0805]  29.97,92.71 0 top
R164  330  [0603]  -33.02,80.26 90 top  (outside the outline)
R165  10K  [0603]  76.71,116.84 180 top
R166  562K  [0603]  76.71,104.14 180 top
R167  10K  [0603]  78.49,119.63 180 top
R168  10K  [0603]  72.9,102.11 180 top
R169  10K  [0603]  76.71,110.24 180 top
R170  DNP  [0603]  84.07,122.68 270 top
R171  DNP  [0603]  79.76,101.09 270 top
R172  10K  [0603]  85.09,105.66 270 top
R173  DNP  [0603]  83.06,105.66 270 top
R174  68  [0603]  55.12,15.49 270 top
R175  68  [0603]  53.34,15.49 270 top
R176  DNP  [0603]  15.75,33.53 90 top
R177  DNP  [0603]  18.03,33.53 90 top
R178  330  [0603]  -35.31,87.88 270 top  (outside the outline)
R179  68  [0603]  51.56,15.49 270 top
R180  7.5K  [0603]  100.33,122.68 270 top
R181  22  [0603]  42.04,19.43 0 top
R182  22  [0603]  38.73,21.46 0 top
R183  1.5K  [0603]  41.91,21.59 0 top
R184  7.5K  [0603]  96.27,122.68 270 top
R185  7.5K  [0603]  85.6,119.63 0 top
R186  7.5K  [0603]  92.2,122.68 270 top
R187  1K  [0603]  55.37,30.48 90 top
R188  DNP  [0603]  86.11,122.68 270 top
R189  0.006  [2512]  115.32,92.46 90 top
R190  2K  [0603]  41.91,25.65 0 top
R191  1K  [0603]  47.5,33.02 180 top
R192  0.006  [2512]  121.67,92.46 90 top
R193  10K  [0603]  39.37,30.23 270 top
R194  7.5K  [0603]  91.44,109.22 180 top
R195  7.5K  [0603]  89.41,123.7 180 top
R196  47K  [0603]  60.2,9.4 0 top
R197  16  [1206]  86.87,111.25 90 top
R198  16  [1206]  83.57,111.25 90 top
R199  47K  [0603]  95.25,37.85 180 top
R200  8.06K  [0603]  80.26,111.51 270 top
R201  42.2K  [0603]  82.3,116.08 270 top
R204  1K  [0603]  57.4,30.48 90 top
RT1  10K  [0603]  56.9,109.73 270 top
S8  [TACTILE-PTH]  52.83,95 0 top
SW3  SPST_TACT-KMR2  [KMR2]  100.84,36.45 0 top
SW5  SPST_TACT-KMR2  [KMR2]  159,88.65 180 top  (outside the outline)
U2  ADC128S102  [TSSOP16]  65.28,59.94 270 top
U3  LTC4002S8  [S8_TI]  60.96,107.7 0 top
U4  LDO_EN_FB  [TSOT23]  54.99,43.56 180 top
U5  NJM2068M  [DMP8_NJM]  49.02,45.21 180 top
U6  SN74HCT541TSSOP20  [TSSOP20]  94.49,52.83 270 top
U7  LTC2952F  [TSSOP20_LT]  38.61,115.57 90 top
U8  SN74HCT541TSSOP20  [TSSOP20]  94.49,62.99 270 top
U9  TPA2008D2  [TSSOP24+1_TI]  53.09,77.47 0 top
U10  ADXL345  [LGA14]  88.52,-17.14 180 top  (outside the outline)
U11  NJM2068M  [DMP8_NJM]  22.35,78.23 270 top
U12  WT32  [WT32_BT_MODULE]  24,11.94 90 top
U13  USBLC6-2  [SOT23-6L]  131.95,-10.92 180 top  (outside the outline)
U14  NJM2068M  [DMP8_NJM]  21.97,58.55 270 top
U15  TPA6130A2QFN20  [QFN20+1]  22.48,44.07 180 top
U16  SN74HCT541TSSOP20  [TSSOP20]  94.49,42.67 270 top
U17  NJM2068M  [DMP8_NJM]  22.61,92.46 270 top
U18  TS5A22364DGS  [MSOP10]  36.07,89.15 0 top
U19  ATMEGA32U4AU  [TQFP44]  149.99,74.8 180 top  (outside the outline)
U20  TS5A22364DGS  [MSOP10]  36.07,95.5 0 top
U21  FLASH-SPI-25XXSMD1  [SO08-EIAJ]  63.5,24.89 180 top
U22  6N138SMD8  [SMD-8]  -41.91,83.06 270 top  (outside the outline)
U23  LT3971  [MSOP10+1_LT]  71.37,108.97 270 top
U24  LDO_EN_FB  [TSOT23]  78.23,122.68 270 top
U25  LDO_EN_FB  [TSOT23]  83.57,101.09 90 top
U26  FLASH-SPI-25XXSMD1  [SO08-EIAJ]  73.79,34.92 90 top
U27  6SLX9TQG144  [TQ144]  84.07,19.05 180 top
U28  FT2232D  [LQFP48]  50.29,23.37 270 top
U29  93C46B  [SOT23-6]  42.67,30.23 0 top
U30  LTC3891  [TSSOP20+1_LT]  93.22,116.59 270 top
U$3  [GADGETFACTORY_LOGO]  -22.86,-11.18 0 top  (outside the outline)
X1  16Mhz  [ABRACOM_CLOCK]  149.86,84.58 0 top  (outside the outline)
X2  [ABRACOM_CLOCK]  50.8,34.04 270 top
~NUDEV~  GND-GNDA  [GND-GNDA]  175.64,104.01 0 top  (outside the outline)

## Tracks (layer width: path | path; a pad name or v marks a point on that pad's centre or on a via)
1V2  (1 unrouted)
  Top 0.203: 84.82,13.45 U27.128 84.82,5.6 84.84,5.59 84.33,5.08 C90.1 | 85.34,24.77 85.32,24.78 U27.52 85.32,34.78 85.6,35.05 85.6,36.83 83.57,38.86 83.57,40.13 82.98,40.72 C89.1 | 90.22,23.8 90.17,23.75 | U27.19 90.3,19.3 | 77.98,19.81 77.97,19.8 U27.89 71.11,19.8 70.1,18.8 C92.1
  Top 0.254: C91.1 U27.19
  pour Top (rank 2): 77.72,12.7 77.72,25.4 90.42,25.4 90.42,12.7
3V3  (via drill 0.38, 0.51)  (27 unrouted)
  Top 0.203: C86.1 85.85,6.1 85.32,6.62 U27.129 85.32,9.89 85.6,10.16 | U27.76 70.47,26.3 69.09,27.69 C93.1 | C100.1 71.7,32.25 U26.8 v73.41,32.51 | U26.3 v76.45,35.05 | U27.125 83.32,11.19 v83.82,11.68 | v86.61,11.68 88.32,9.97 U27.135 88.32,6.93 88.9,6.35 88.9,4.06 90.17,2.79 C98.1 | U27.103 74.58,12.8 v74.93,12.45 | U27.86 76.49,21.3 v76.71,21.08 | U27.4 97,11.8 C97.1 | U27.42 90.32,32.28 90.68,32.39 C95.1 | IC2.1 101.61,13.45 102.11,12.95 102.87,12.95 103.21,13.3 IC2.3 | U27.31 97.57,25.3 C99.1 | IC2.27 122.65,13.88 122.78,13.74 C96.1 | U27.53 84.82,35.04 85.09,35.31 85.09,36.58 83.21,38.46 C87.1 | U27.90 71.37,19.3 68.96,16.89 C85.1
  Top 0.254: U26.8 U26.7 | U27.103 71,12.8 C94.1 | U27.122 81.79,7.91 | U27.4 93.99,11.8 93.85,11.94 | U27.18 93.48,18.8 93.47,18.8 | U27.31 93.57,25.3 93.47,25.4 | U27.53 84.82,29.98 84.84,29.97 | U27.63 79.82,28.63 80.01,28.45 | U27.69 76.82,29.07 76.2,28.45 | U27.76 74.05,26.3 74.42,26.67 | U27.90 75.44,19.3 75.69,19.05 | R199.2 v93.22,37.85
  Bottom 0.203: v76.45,35.05 73.91,35.05 73.15,34.29 v73.41,32.51 | v111.81,17.32 110.49,16 110.49,13.46 109.73,12.7 108.1,12.7 v108,12.8
  Bottom 0.406: v86.61,11.68 v83.82,11.68 | v76.71,18.8 v76.71,21.08
  Bottom 0.61: v76.58,12.45 v74.93,12.45 73.66,12.45
3V3OUT_A
  Top 0.254: U28.6 44.76,23.68 44.2,23.11 44.2,21.59 43.18,20.57 40.64,20.57 40.39,20.32 40.39,19.81 40,19.43 C142.2
!CAS
  Top 0.203: U27.5 99.97,12.3 102.11,10.16 112.65,10.16 114.41,11.92 IC2.17
!RAS
  Top 0.203: U27.2 96.39,10.8 97.54,9.65 113.03,9.65 115.21,11.84 IC2.18
!WE
  Top 0.203: U27.6 100.1,12.8 102.23,10.67 112.4,10.67 113.61,11.89 IC2.16
+3V3  (via drill 0.36, 0.51)  (31 unrouted)
  Top 0.254: C57.1 C58.1 | C108.1 157.99,66.8 155.01,69.78 U19.44 | C106.1 148.34,66.8 v148.59,67.06 148.76,67.22 U19.34 | U23.P$1 69.33,110.73 70.36,111.76 72.14,111.76 72.8,112.42 L14.P$2 v74.93,114.55 D14.1 | U28.31 55.68,23.68 v55.88,23.88 | U28.26 55.72,21.18 v56.13,21.08 | U28.14 48.15,17.89 v48.26,17.78 | U28.10 45.3,21.68 45.21,21.59 v45.21,19.3
  Top 0.381: C138.1 C134.1 80.96,103.57 v80.52,103.12 78.99,103.12 77.98,102.11 R156.2 C129.1 78.49,100.08 78.8,100.39 R171.2 80.71,100.39 80.96,100.14 U25.5 | 74.17,119.63 73.15,119.63 72.9,119.89 C132.P$2 71.37,119.89 71.12,119.63 70.1,119.63
  Bottom 0.254: v74.93,114.55 74.93,108.71 v80.52,103.12
  other vias: 72.14,118.36
  pour POWER (isolate 0.762, rank 6): 127,0.76 127,46.23 36.07,46.23 36.07,37.85 1.27,37.85 1.27,0.76
  pour Top (isolate 0.635, rank 3): 69.34,119.89 74.42,119.89 74.42,114.3 71.12,114.3 71.12,117.09 69.34,118.87
+5V  (via drill 0.36, 0.38, 0.51)  (53 unrouted)
  Top 0.254: U4.1 55.94,45.91 55.69,46.16 C18.1 57.28,47.37 58.04,48.13 | U9.16 54.71,82.65 v55.12,83.06 | R200.2 80.26,110.24 80.85,109.65 R198.P$1 84.15,109.65 86.61,107.19 86.61,103.38 88.14,101.85 109.47,101.85 110.24,101.09 110.24,94.23 112.52,91.95 112.52,90.17 113.03,89.66 R189.1 | U9.4 51.46,71.53 v51.05,71.12 | U25.1 85.92,100.14 v86.87,101.09 | R180.1 100.33,124.71 100.84,125.22 v101.35,125.22 | U9.9 54.71,73 54.61,72.9 v54.61,68.58 | v54.61,68.58 55.63,67.56 C43.1 | U9.21 51.46,82.65 v51.05,83.06 | U9.13 58.03,80.4 v58.17,80.26 58.34,80.09 C42.P$1 | C140.1 43.18,23.62 44.24,24.68 | U28.4 44.24,24.68 | 44.24,24.68 44.74,25.18 U28.3 50.07,25.18 50.65,25.76 U28.42 50.65,29.57 v50.8,29.72 50.8,30.8 C139.1 | R193.1 40.07,30.93 40.67,31.53 U29.6 41.72,33.34 42.42,34.04 C169.1 | R65.1 48.77,64.52 52.83,68.58 v54.61,68.58
  Top 0.381: v55.12,83.06 55.12,84.07 54.93,84.27 R62.1 53.15,85.03 53.53,85.66 C44.1
  Top 0.508: C148.P$1 C151.P$1 C150.P$1
  Top 0.635: C152.P$1 C155.P$1 C153.P$1
  pour Top (isolate 0.635, rank 3): 123.95,91.69 123.95,86.61 121.67,84.33 59.44,84.33 59.44,91.69
  pour POWER (isolate 0.762, rank 5): 125.98,125.73 125.98,28.45 91.44,28.45 91.44,46.48 48.77,46.48 49.02,91.19 58.93,91.19 58.67,101.85 100.33,101.85 100.33,125.73
_KILL  (via drill 0.36)  (1 unrouted)
  Top 0.254: U7.P$3 42.52,113.94 42.93,113.54 42.93,111 v43.18,110.74
A0
  Top 0.203: U27.140 90.82,6.2 91.69,5.33 113.16,5.33 119.21,11.39 IC2.23
A1
  Top 0.203: U27.139 90.32,5.94 91.44,4.83 113.54,4.83 120.01,11.3 IC2.24
A2
  Top 0.203: U27.138 89.82,5.68 91.19,4.32 113.79,4.32 120.81,11.34 IC2.25
A3
  Top 0.203: U27.137 89.32,5.42 90.93,3.81 114.17,3.81 121.61,11.25 IC2.26
A4
  Top 0.203: IC2.29 121.61,27.99 118.11,31.5 100.84,31.5 96.52,35.81 90.93,35.81 88.32,33.21 U27.46
A5
  Top 0.203: IC2.30 120.81,27.78 117.6,30.99 100.71,30.99 96.39,35.31 91.19,35.31 88.82,32.94 U27.45
A6
  Top 0.203: U27.44 89.32,32.68 91.44,34.8 96.27,34.8 100.58,30.48 117.09,30.48 120.01,27.56 IC2.31
A7
  Top 0.203: U27.43 89.82,32.42 91.69,34.29 96.14,34.29 100.46,29.97 116.59,29.97 119.21,27.34 IC2.32
A8
  Top 0.203: U27.41 90.82,31.39 91.44,32 97.79,32 100.33,29.46 116.08,29.46 118.41,27.13 IC2.33
A9
  Top 0.203: U27.40 91.32,31.25 91.69,31.5 97.66,31.5 100.2,28.96 115.57,28.96 117.61,26.91 IC2.34
A10
  Top 0.203: U27.141 91.32,6.47 91.95,5.84 112.78,5.84 118.41,11.48 IC2.22
A11
  Top 0.203: U27.35 96.13,27.3 97.28,28.45 115.06,28.45 116.81,26.7 IC2.35
A12
  Top 0.203: U27.34 96.4,26.8 97.54,27.94 114.55,27.94 116.01,26.48 IC2.36
ACC_INT1  (1 unrouted)
ACC_INT2  (1 unrouted)
ADC_IN2  (2 unrouted)
ADC_IN3  (2 unrouted)
ADC_IN4  (3 unrouted)
ADC_IN5  (3 unrouted)
ADC_IN6  (3 unrouted)
ADC_IN7  (3 unrouted)
AOL_N  (via drill 0.36)  (1 unrouted)
  Top 0.254: U18.4 36.57,88.13 36.83,88.39 38.1,88.39 v38.35,88.14
  Bottom 0.254: v38.35,88.14 37.34,88.14 36.58,88.9 36.58,91.95 38.1,93.47 41.15,93.47 41.15,63.2
AOL_P  (via drill 0.36)  (1 unrouted)
  Top 0.254: U18.8 36.07,90.42 36.58,89.92 38.1,89.92 38.35,90.17 v38.35,90.93
  Bottom 0.254: v38.35,90.93 38.35,92.2 38.86,92.71 39.88,92.71 40.64,91.95 40.64,63.55
AOR_N  (via drill 0.36)  (1 unrouted)
  Top 0.254: U20.4 36.57,94.48 36.83,94.74 38.1,94.74 v38.35,94.49
  Bottom 0.254: v38.35,94.49 38.61,94.23 41.15,94.23 41.66,93.73 41.66,62.74
AOR_P  (via drill 0.36)  (1 unrouted)
  Top 0.254: U20.8 36.07,96.52 36.32,96.27 37.97,96.27 38.35,96.65 v38.35,97.41
  Bottom 0.254: v38.35,97.41 40.26,97.41 41.15,96.52 41.15,95.25 42.16,94.23 42.16,62.23
AREF
  Top 0.254: R141.2 152.4,66.8 152.76,67.16 U19.42 | C124.1 R141.2 | R141.2 153.22,65.72 153.42,65.53 153.42,64.77 153.86,64.32 R135.1
AUX_IN_L  (1 unrouted)
  Top 0.381: C56.1 9.65,73.66 JP26.TIP
AUX_IN_L_N
  Top 0.254: U18.2 35.57,88.13 35.31,88.39 34.54,88.39 33.02,86.87 33.02,84.07 32,83.06 R115.2
AUX_IN_L_P
  Top 0.254: R69.2 32,85.6 32.51,86.11 32.51,87.38 35.07,89.93 U18.10
AUX_IN_R  (1 unrouted)
  Top 0.381: C112.1 8.93,86.57 9.57,85.93 JP26.RING
AUX_IN_R_N
  Top 0.254: U20.2 35.57,94.23 35.31,94.49 34.04,94.49 32.26,92.71 R163.2
AUX_IN_R_P
  Top 0.254: R125.2 32.51,95.25 34.81,97.55 U20.10
AUX_OUT_L  (via drill 0.38)  (2 unrouted)
  Top 0.381: JP28.TIP 9.99,43.26 11.3,43.31 R109.2 | C116.P$2 v31.24,65.15 31.24,66.29 30.54,66.99 R138.2 30.54,69.28 30.42,69.4 R137.2
  Bottom 0.254: 16,47.15 JP28.TIP
AUX_OUT_R  (1 unrouted)
  Top 0.381: R112.2 12.32,49.15 11,53.26 JP28.RING 9.57,54.53 11.94,56.9 11.94,66.04 12.7,68.83 13.54,69.67 C77.P$2 16.59,69.67 18.22,71.31 R104.2 19.24,71.37 R105.2
BA0
  Top 0.203: U27.143 92.32,6.99 92.46,6.86 112.01,6.86 116.81,11.66 IC2.20
BA1
  Top 0.203: U27.142 91.82,6.73 92.2,6.35 112.52,6.35 117.61,11.44 IC2.21
BT_CLK  (1 unrouted)
BT_CTS  (1 unrouted)
BT_MIC_BIAS  (1 unrouted)
BT_MISO  (1 unrouted)
BT_MOSI  (1 unrouted)
BT_RTS  (1 unrouted)
BT_SPICS  (1 unrouted)
BUFFER_EN  (6 unrouted)
  Top 0.254: U8.19 95.01,65.78 94.36,66.42 U8.1
CKE
  Top 0.203: U27.33 96.66,26.3 97.79,27.43 114.05,27.43 115.21,26.26 IC2.37
CLK
  Top 0.203: U27.32 96.92,25.8 98.04,26.92 113.54,26.92 114.41,26.05 IC2.38
CS
  Top 0.203: U27.1 96.13,10.3 97.28,9.14 113.41,9.14 116.01,11.75 IC2.19
D+  (3 unrouted)
D+1  (2 unrouted)
D+_IC
  Top 0.254: U19.3 157.84,72.29 158.5,71.63 158.5,70.36 158.75,70.1 R126.1
D-  (3 unrouted)
D-1  (2 unrouted)
D-_IC
  Top 0.254: U19.4 158.1,72.79 158.5,72.39 R130.1
DO_A
  Top 0.254: R190.1 41.21,27.49 41.72,28.01 U29.1 40.92,28.93 40.32,29.53 R193.2
DQ0
  Top 0.203: U27.9 99.52,14.3 100.08,14.86 102.11,14.86 102.41,14.55 IC2.2
DQ1
  Top 0.203: U27.10 99.25,14.8 99.82,15.37 103.5,15.37 104.01,14.86 IC2.4
DQ2
  Top 0.203: U27.11 98.99,15.3 99.57,15.88 104.39,15.88 104.81,15.45 IC2.5
DQ3
  Top 0.203: U27.12 98.73,15.8 99.31,16.38 105.54,16.38 106.41,15.51 IC2.7
DQ4
  Top 0.203: IC2.8 107.21,15.85 106.26,16.8 U27.14
DQ5
  Top 0.203: IC2.10 108.81,15.9 107.41,17.3 U27.15
DQ6
  Top 0.203: IC2.11 109.61,16.62 108.44,17.8 U27.16
DQ7
  Top 0.203: U27.8 100.5,13.8 102.62,11.68 109.98,11.68 111.21,12.92 IC2.13
DQ8
  Top 0.203: IC2.42 111.21,22.06 109.45,20.3 U27.21
DQ9
  Top 0.203: IC2.44 109.61,22.49 107.92,20.8 U27.22
DQ10
  Top 0.203: IC2.45 108.81,22.96 107.15,21.3 U27.23
DQ11
  Top 0.203: IC2.47 107.21,23.39 105.62,21.8 U27.24
DQ12
  Top 0.203: U27.26 96.33,22.8 96.77,22.35 105.16,22.35 106.41,23.61 IC2.48
DQ13
  Top 0.203: U27.27 96.59,23.3 97.03,22.86 104.14,22.86 104.81,23.53 IC2.50
DQ14
  Top 0.203: U27.29 96.22,24.3 97.16,23.37 102.87,23.37 104.01,24.51 IC2.51
DQ15
  Top 0.203: U27.30 96.36,24.8 97.28,23.88 101.85,23.88 102.41,24.44 IC2.53
DQMH
  Top 0.203: U27.17 100.34,18.3 101.85,19.81 110.74,19.81 113.61,22.68 IC2.39
DQML
  Top 0.203: IC2.15 112.81,11.98 112.01,11.18 102.36,11.18 100.24,13.3 U27.7
EECS_A
  Top 0.254: U28.48 46.23,27.68 45.47,28.45 45.47,31.75 44.45,32.77 42.93,32.77 42.67,32.51 U29.5
EEDATA_A  (1 unrouted)
  Top 0.254: U28.2 43.69,25.68 | 43.69,25.68 42.91,25.68 | U29.3 43.62,25.75 43.69,25.68
EESK
  Top 0.254: U28.1 46.15,26.75 44.96,27.94 44.96,30.73 44.17,31.53 U29.4
EN
  Top 0.254: U7.P$14 35.09,116.55 33.21,118.43 R45.1
FILTERED_VCC_A
  Top 0.254: U28.46 48.65,29.82 48.33,30.15 C141.2 R191.1
FLASH_CS  (via drill 0.38)  (2 unrouted)
  Top 0.203: v88.65,26.42 91.19,26.42 92.32,27.55 U27.38 | U26.1 78.44,33.07 v79.5,32
  Bottom 0.254: v88.65,26.42 88.65,27.18
FLASH_SCK  (1 unrouted)
  Top 0.203: U26.6 72.64,35.05 73.15,34.54 73.15,33.27 74.42,32 75.18,31.5 75.95,31.5 76.32,31.12 U27.70
FLASH_SI  (via drill 0.38)
  Top 0.203: U26.5 74.17,36.32 74.42,35.81 v74.42,33.53 | U27.64 79.32,27.25 78.99,26.92 76.96,26.92 v76.45,27.43
  Bottom 0.203: v76.45,27.43 74.93,28.96 v74.42,33.53
FLASH_SO
  Top 0.203: U26.2 76.71,33.78 76.45,33.53 76.71,32.26 77.22,32 77.98,32 78.82,31.16 U27.65
GND  (via drill 0.36, 0.38, 0.51, 0.64)  (313 unrouted)
  Top 0.178: 35.75,123.19 C39.2
  Top 0.2: U28.18 v50.15,17.69
  Top 0.203: U27.113 77.32,9.12 v77.85,9.65 | U27.108 74.31,10.3 v74.55,10.54 | U27.96 74.63,16.3 v74.68,16.26 | U27.91 74.67,18.8 v74.93,18.54 | U27.77 74.66,25.8 v74.68,25.78 | U27.73 74.56,27.8 v74.68,27.69 | U27.68 77.32,28.59 v77.47,28.45 | U27.60 81.32,27.48 v81.28,27.43 | U27.49 86.82,28.49 v86.87,27.43 | U27.25 93.52,22.3 v93.47,22.35 | U27.13 93.52,16.3 v93.47,16.26 | U27.144 92.82,9.54 v92.71,9.65 | U27.136 88.82,9.58 v89.41,10.16 | v95.76,32.89 C95.2 | C98.2 v93.98,2.79 | C100.2 73.83,29.88 v73.91,29.97 | U26.4 v76.45,36.32 | U27.130 85.82,9.12 v86.61,9.91 | U27.54 84.32,28.7 v83.82,27.43 | U27.3 v93.22,11.3 | IC2.28 122.41,23.86 v121.92,23.37 | IC2.41 112.01,23.62 v112.27,23.37 | IC2.46 108.01,23.43 v107.95,23.37 | IC2.12 110.41,15.16 110.74,15.49 111.51,15.49 v111.76,15.75 | IC2.6 105.61,15.21 v105.56,15.27 | C99.2 100.48,24.99 v100.74,25.25 | IC2.54 100.75,25.24 v100.74,25.25 | IC2.52 103.21,26.02 103.12,26.11 100.94,26.11 100.74,25.91 v100.74,25.25 | C96.2 122.78,9.12 v122.83,9.07
  Top 0.254: R35.1 R54.1 | X1.4 148.84,85.09 148.53,85.41 C121.2 | C120.2 150.05,86.3 149.92,86.17 X1.4 | X1.2 150.11,84.33 149.61,85.09 X1.4 | U9.7 53.41,72.9 | 53.41,72.9 53.41,72.21 v53.34,72.14 | U9.6 52.76,73.55 53.41,72.9 | U9.18 53.41,82.04 | 53.41,82.04 53.41,82.73 v53.09,83.06 | U9.19 52.76,81.39 53.41,82.04 | C58.2 C57.2 | R166.1 78.49,104.14 78.49,111 77.98,111.51 C137.2 R169.1 | R168.1 73.85,104.71 73.41,105.16 C130.P$2 72.47,106.35 v71.37,107.44 U23.P$11 | U24.2 76.2,122.68 | U7.P$12 34.81,117.84 34.54,118.11 34.54,122.94 34.8,123.19 35.75,123.19 | U19.5 158.12,73.29 158.5,73.66 160.53,73.66 | U19.43 154.02,68.99 v153.92,67.06 | v100.08,19.3 C91.2 | C97.2 99.69,11.3 v100.33,10.67 | v98.04,29.72 C88.2 | C94.2 v68.07,12.7 | v84.33,1.02 85.6,1.02 | 84.33,2.29 C90.2 | U28.9 47.71,22.18 v47.96,21.93 | U28.45 49.15,26.04 v49.28,25.91 | C165.1 53.53,34.61 53.59,34.54 52.32,34.54 52.01,34.86 X2.4 51.44,34.67 50.16,33.4 X2.2 | U28.34 v55.88,25.18 | U28.25 54.65,20.28 55.12,19.81 v55.63,19.81 | U28.47 48.15,28.56 v46.99,29.72 46.92,29.78 C141.1 | U29.2 v42.67,27.43 | C168.1 v45.72,35.05 45.21,35.05 44.9,34.74 C169.2
  Top 0.381: U30.P$11 95.99,113.56 96.01,112.78 96.27,112.52 v96.77,112.78